# Altium project UU101_UUControl_MainBoard.PrjPcb
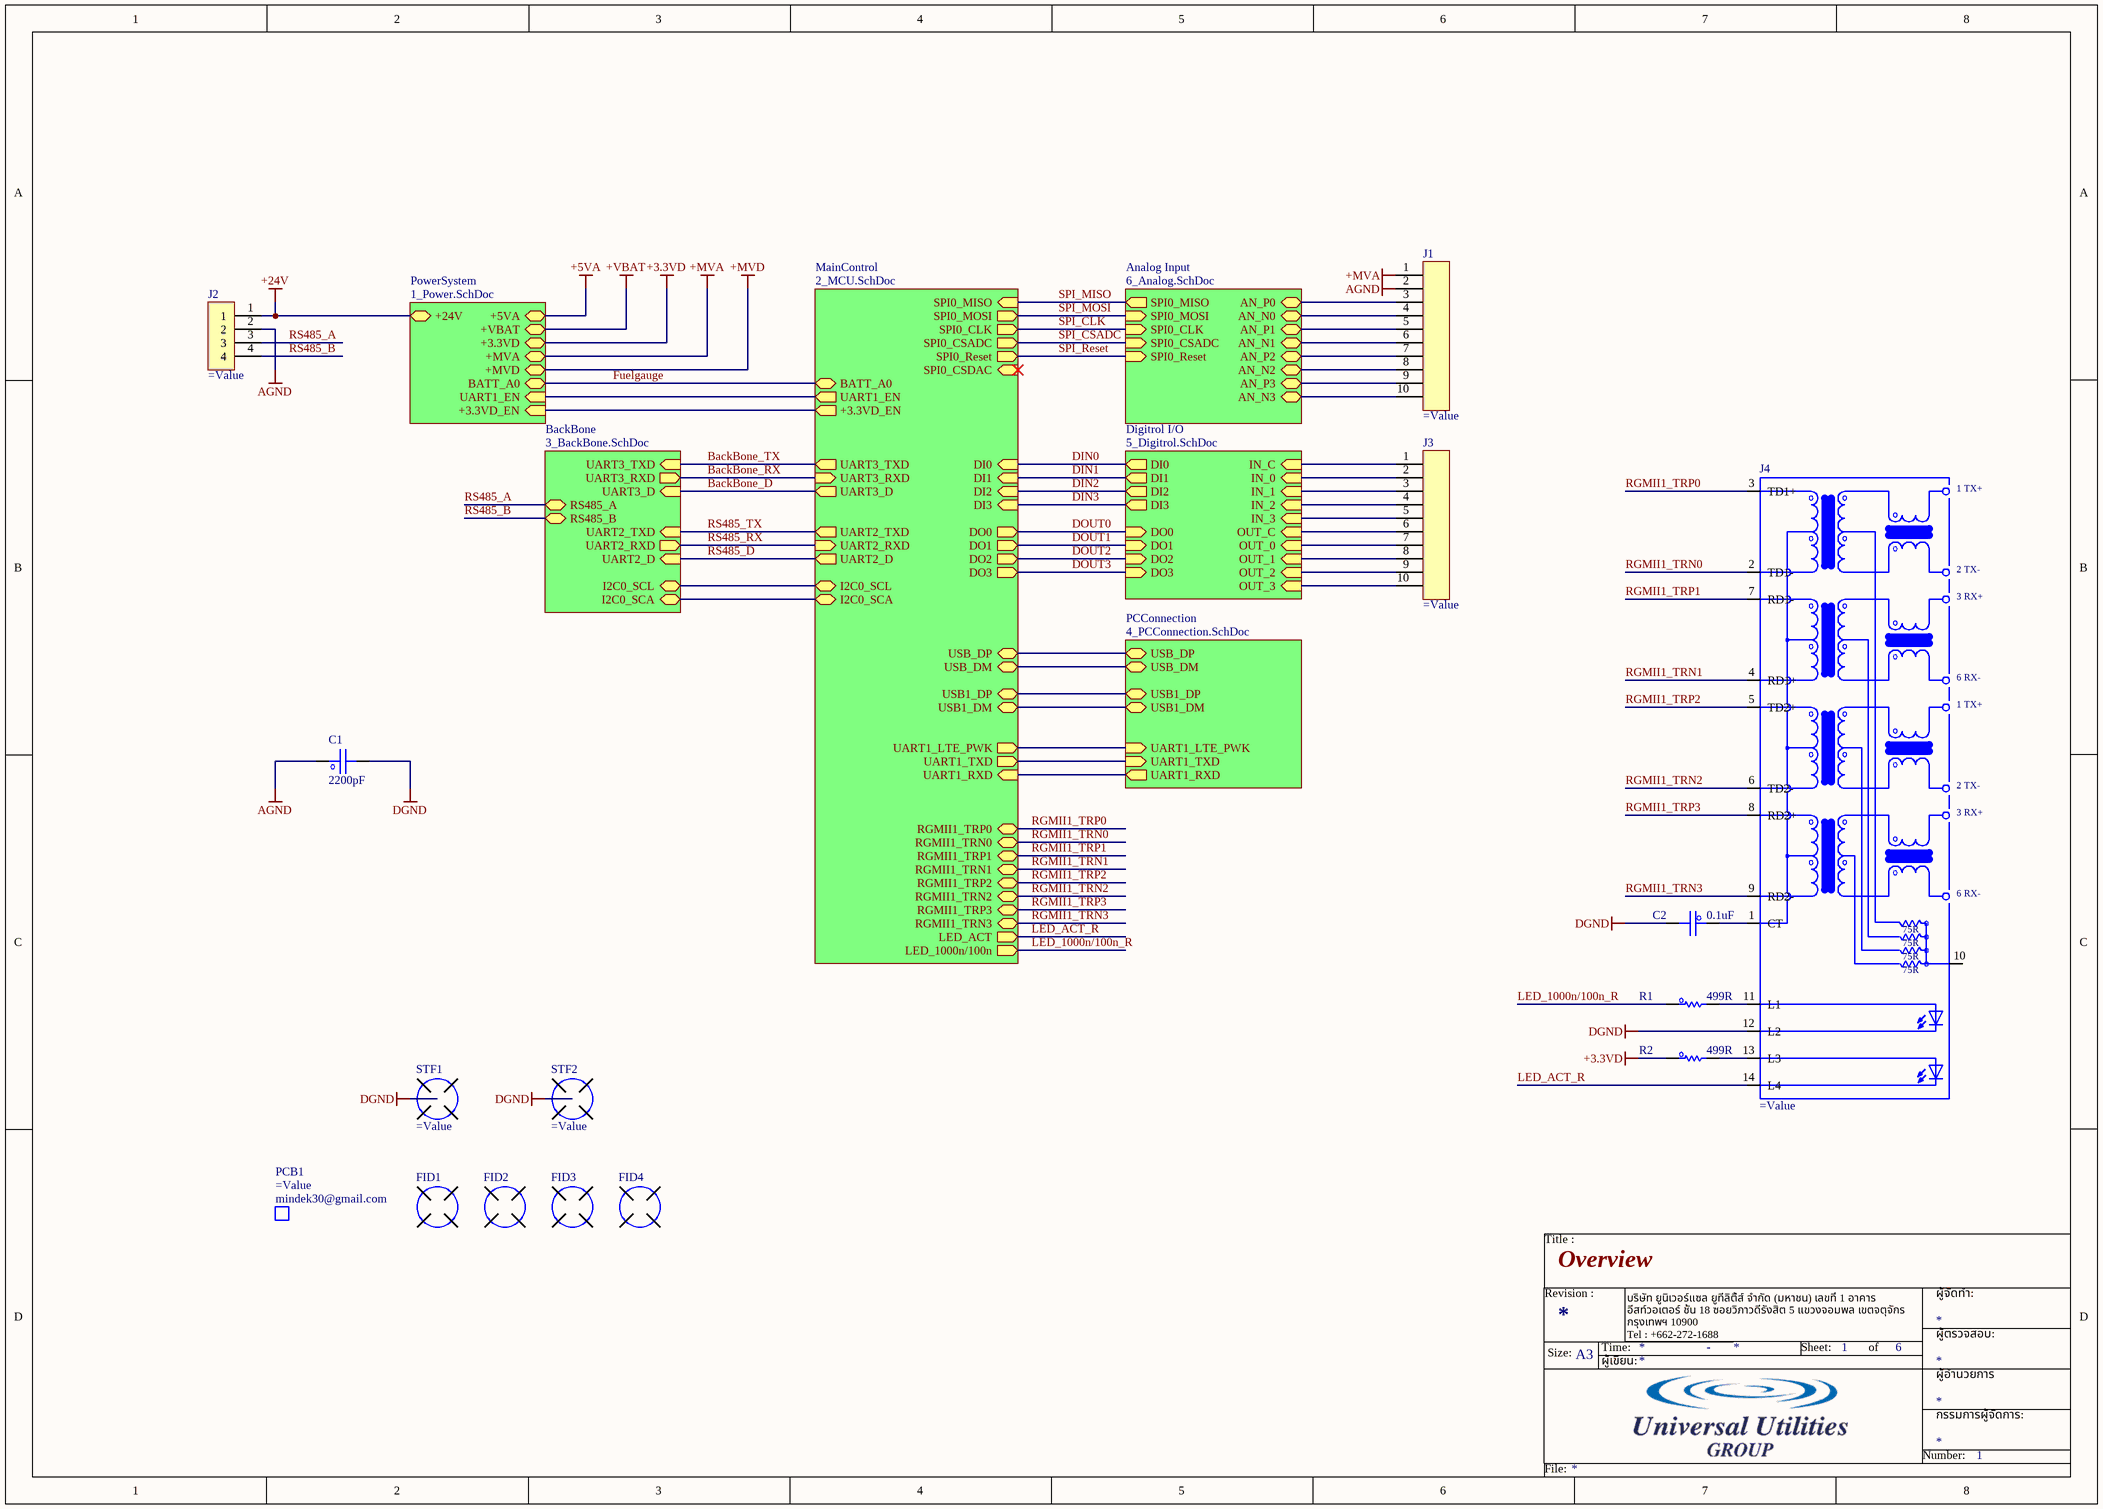
[diagram p0: 0_Overview.SchDoc]
PCB_Name: UU Control Board Mainboard; PCB_PN: UU101; PCB_Rev: B; PCBA_PN: UU101; PCBA_Rev: B
7 sheets, 214 parts. Net scope: hierarchical (ports join the sheet entries above them; power ports are global).
Board file: UU101_UUControl_MainBoard.PcbDoc
Sheets:
  0_Overview.SchDoc
    MainControl = 2_MCU.SchDoc
    Analog Input = 6_Analog.SchDoc
    Digitrol I/O = 5_Digitrol.SchDoc
    PowerSystem = 1_Power.SchDoc
    BackBone = 3_BackBone.SchDoc
    PCConnection = 4_PCConnection.SchDoc

## Sheet 0_Overview.SchDoc: Overview
size A3; DocumentNumber: 1; SheetNumber: 1; SheetTotal: 6; PageSetup: Record=PageOptions|CenterHorizontal=True|CenterVertical=True|PrintScale=1.01|XCorrection=1.00|YCorrection=1.00|PrintKind=0|BorderSize=5000000|LeftOffset=0|BottomOffset=0|Orientation=2|PaperLength=1000|PaperWidth=1000|Scale=100|PaperSource=7|PrintQuality=-4|MediaType=1|DitherType=10|PaperKind=A3|PrintScaleMode=1

### Parts
C1  2200pF  [C_1206]
C2  0.1uF  [C_0603]
FID1  FIDUCIAL  [FID]  (value not drawn)  (no BOM)
FID2  FIDUCIAL  [FID]  (value not drawn)  (no BOM)
FID3  FIDUCIAL  [FID]  (value not drawn)  (no BOM)
FID4  FIDUCIAL  [FID]  (value not drawn)  (no BOM)
J1  (no value)  [CON_10P_Terminal]
J2  (no value)  [CON_4P_Terminal]
J3  (no value)  [CON_10P_Terminal]
J4  (no value)  [HY911103A_HAN]
PCB1  Manufacturer: mindek30@gmail.com  (mechanical)
R1  499R  [R_0603]
R2  499R  [R_0603]
STF1  (no value)  [StandOff]
STF2  (no value)  [StandOff]

### Sub-sheets
Analog Input = 6_Analog.SchDoc: SPI0_MISO (out), SPI0_MOSI (in), SPI0_CLK (in), SPI0_CSADC (in), SPI0_Reset (in), AN_P0 (bidir), AN_P1 (bidir), AN_P2 (bidir), AN_P3 (bidir), AN_N0 (bidir), AN_N1 (bidir), AN_N2 (bidir), AN_N3 (bidir)
BackBone = 3_BackBone.SchDoc: UART2_D (in), UART3_TXD (in), UART3_RXD (out), UART3_D (in), UART2_TXD (in), UART2_RXD (out), RS485_A (bidir), RS485_B (bidir), I2C0_SCL (bidir), I2C0_SCA (bidir)
Digitrol I/O = 5_Digitrol.SchDoc: DI0 (out), DI1 (out), DI2 (out), DI3 (out), DO0 (in), DO1 (in), DO2 (in), DO3 (in), IN_0 (in), IN_1 (in), IN_2 (in), IN_3 (in), OUT_0 (in), OUT_1 (in), OUT_2 (in), OUT_3 (in), OUT_C (in), IN_C (in)
MainControl = 2_MCU.SchDoc: SPI0_MISO (in), SPI0_MOSI (out), SPI0_CLK (out), DI0 (in), DI1 (in), DI2 (in), DI3 (in), DO0 (out), DO1 (out), DO2 (out), DO3 (out), SPI0_Reset (out), UART3_TXD (out), UART3_RXD (in), UART3_D (out), BATT_A0 (bidir), SPI0_CSADC (out), UART2_TXD (out), UART2_RXD (in), UART2_D (out), USB_DP (bidir), USB_DM (bidir), UART1_RXD (in), UART1_EN (out), UART1_TXD (out), I2C0_SCL (bidir), I2C0_SCA (bidir), USB1_DP (bidir), USB1_DM (bidir), RGMII1_TRN0 (bidir), RGMII1_TRP3 (bidir), RGMII1_TRP0 (bidir), RGMII1_TRP2 (bidir), RGMII1_TRP1 (bidir), RGMII1_TRN2 (bidir), RGMII1_TRN3 (bidir), RGMII1_TRN1 (bidir), LED_ACT (out), LED_1000n/100n (out), SPI0_CSDAC (in), +3.3VD_EN (out), UART1_LTE_PWK (out)
PCConnection = 4_PCConnection.SchDoc: UART1_TXD (in), UART1_RXD (out), USB1_DP (bidir), USB1_DM (bidir), USB_DM (bidir), USB_DP (bidir), UART1_LTE_PWK (in)
PowerSystem = 1_Power.SchDoc: +5VA (bidir), +24V (bidir), +3.3VD (bidir), +MVA (bidir), +MVD (bidir), BATT_A0 (bidir), +VBAT (bidir), UART1_EN (in), +3.3VD_EN (in)

### Nets
+3.3VD: R2.1 ; sheet PowerSystem/+3.3VD
+24V: J2.1 ; sheet PowerSystem/+24V
+MVA: J1.1 ; sheet PowerSystem/+MVA
AGND: C1.1 J1.2 J2.2
DGND: C1.2 C2.2 J4.12(L2) STF1.1 STF2.1
BackBone_D: sheet MainControl/UART3_D, sheet BackBone/UART3_D
BackBone_RX: sheet MainControl/UART3_RXD, sheet BackBone/UART3_RXD
BackBone_TX: sheet MainControl/UART3_TXD, sheet BackBone/UART3_TXD
DIN0: sheet MainControl/DI0, sheet Digitrol I/O/DI0
DIN1: sheet MainControl/DI1, sheet Digitrol I/O/DI1
DIN2: sheet MainControl/DI2, sheet Digitrol I/O/DI2
DIN3: sheet MainControl/DI3, sheet Digitrol I/O/DI3
DOUT0: sheet MainControl/DO0, sheet Digitrol I/O/DO0
DOUT1: sheet MainControl/DO1, sheet Digitrol I/O/DO1
DOUT2: sheet MainControl/DO2, sheet Digitrol I/O/DO2
DOUT3: sheet MainControl/DO3, sheet Digitrol I/O/DO3
Fuelgauge: sheet MainControl/BATT_A0, sheet PowerSystem/BATT_A0
HUSB1_DM: sheet MainControl/USB1_DM, sheet PCConnection/USB1_DM
HUSB1_DP: sheet MainControl/USB1_DP, sheet PCConnection/USB1_DP
I2C0_SCA: sheet MainControl/I2C0_SCA, sheet BackBone/I2C0_SCA
I2C0_SCL: sheet MainControl/I2C0_SCL, sheet BackBone/I2C0_SCL
INCom: J3.1 ; sheet Digitrol I/O/IN_C
INPUT0: J3.2 ; sheet Digitrol I/O/IN_0
INPUT1: J3.3 ; sheet Digitrol I/O/IN_1
INPUT2: J3.4 ; sheet Digitrol I/O/IN_2
INPUT3: J3.5 ; sheet Digitrol I/O/IN_3
LED_1000n/100n_R: R1.1 ; sheet MainControl/LED_1000n/100n
LED_ACT_R: J4.14(L4) ; sheet MainControl/LED_ACT  [project net LED_ACT]
OUTCom: J3.6 ; sheet Digitrol I/O/OUT_C
OUTPUT0: J3.7 ; sheet Digitrol I/O/OUT_0
OUTPUT1: J3.8 ; sheet Digitrol I/O/OUT_1
OUTPUT2: J3.9 ; sheet Digitrol I/O/OUT_2
OUTPUT3: J3.10 ; sheet Digitrol I/O/OUT_3
RGMII1_TRN0: J4.2(TD1-) ; sheet MainControl/RGMII1_TRN0
RGMII1_TRN1: J4.4(RD1+) ; sheet MainControl/RGMII1_TRN1
RGMII1_TRN2: J4.6(TD2-) ; sheet MainControl/RGMII1_TRN2
RGMII1_TRN3: J4.9(RD2-) ; sheet MainControl/RGMII1_TRN3
RGMII1_TRP0: J4.3(TD1+) ; sheet MainControl/RGMII1_TRP0
RGMII1_TRP1: J4.7(RD1-) ; sheet MainControl/RGMII1_TRP1
RGMII1_TRP2: J4.5(TD2+) ; sheet MainControl/RGMII1_TRP2
RGMII1_TRP3: J4.8(RD2+) ; sheet MainControl/RGMII1_TRP3
RS485_A: J2.3 ; sheet BackBone/RS485_A
RS485_B: J2.4 ; sheet BackBone/RS485_B
RS485_D: sheet MainControl/UART2_D, sheet BackBone/UART2_D
RS485_RX: sheet MainControl/UART2_RXD, sheet BackBone/UART2_RXD
RS485_TX: sheet MainControl/UART2_TXD, sheet BackBone/UART2_TXD
SIM_RESET: sheet MainControl/UART1_LTE_PWK, sheet PCConnection/UART1_LTE_PWK
SPI_CLK: sheet MainControl/SPI0_CLK, sheet Analog Input/SPI0_CLK  [project net SPI0_SCK]
SPI_CSADC: sheet MainControl/SPI0_CSADC, sheet Analog Input/SPI0_CSADC
SPI_MISO: sheet MainControl/SPI0_MISO, sheet Analog Input/SPI0_MISO  [project net SPI0_MISO]
SPI_MOSI: sheet MainControl/SPI0_MOSI, sheet Analog Input/SPI0_MOSI  [project net SPI0_MOSI]
SPI_Reset: sheet MainControl/SPI0_Reset, sheet Analog Input/SPI0_Reset
UART1_LTE_EN: sheet MainControl/UART1_EN, sheet PowerSystem/UART1_EN
UART1_LTE_RX: sheet MainControl/UART1_RXD, sheet PCConnection/UART1_RXD
UART1_LTE_TX: sheet MainControl/UART1_TXD, sheet PCConnection/UART1_TXD
USB_DM: sheet MainControl/USB_DP, sheet PCConnection/USB_DP
USB_DP: sheet MainControl/USB_DM, sheet PCConnection/USB_DM
NetC2_1: C2.1 J4.1(CT)
NetJ1_3: J1.3 ; sheet Analog Input/AN_P0
NetJ1_4: J1.4 ; sheet Analog Input/AN_N0
NetJ1_5: J1.5 ; sheet Analog Input/AN_P1
NetJ1_6: J1.6 ; sheet Analog Input/AN_N1
NetJ1_7: J1.7 ; sheet Analog Input/AN_P2
NetJ1_8: J1.8 ; sheet Analog Input/AN_N2
NetJ1_9: J1.9 ; sheet Analog Input/AN_P3
NetJ1_10: J1.10 ; sheet Analog Input/AN_N3
NetJ4_11: J4.11(L1) R1.2
NetJ4_13: J4.13(L3) R2.2
NetJ201_12: sheet MainControl/+3.3VD_EN, sheet PowerSystem/+3.3VD_EN

Not connected (* = marked no-connect by the designer): J4 10(CT)

### Notes on the sheet
- Title :
- Revision :
- ผู้จัดทำ:
- Size:
- A3
- Time:
- ผู้เขียน:
- บริษัท ยูนิเวอร์แซล ยูทีลิตี้ส์ จำกัด (มหาชน) เลขที่ 1 อาคาร อีสท์วอเตอร์ ชั้น 18 ซอยวิภาวดีรังสิต 5 แขวงจอมพล เขตจตุจักร กรุงเทพฯ 10900
  Tel : +662-272-1688
  Fax :+662-2721690-1
- -
- Sheet:
- of
- ผู้อำนวยการ
- ผู้ตรวจสอบ:
- Number:
- กรรมการผู้จัดการ:
- File:
- (in symbol CON_RJ45_1) 1 TX+; 2 TX-; 3 RX+; 6 RX-; 75R

### Library data of the parts
C1 = C_Capacitor: CAP CER 2200PF 1KV X7R 1206; Manufacturer: AVX Corporation; PartNumber: 1206AC222KAT1A; PackageReference: 1206; PartID: 478-2953-1-ND; Value2: 1kV; Value: 2200pF; Value3: *
C2 = C_Capacitor: CAP CER 0.1UF 50V X7R 0603; Manufacturer: KEMET; PartNumber: C0603C104K5RACTU; PackageReference: 0603; PartID: 399-5089-1-ND; Value2: 50V; Value: 0.1uF; Value3: *
FID1-FID4 = FID_FIDUCIAL: Manufacturer: mindek30@gmail.com; PartNumber: UU101_B; Value2: Non SE; Value: Non SE; PartID: B; PackageReference: Non SE; Value3: Non SE
J1 J3 = CON_10P_Terminal: TERM BLOCK HDR 10POS 90DEG 3.5MM; PartNumber: 1843871; Manufacturer: Phoenix Contact; Value: 1843871; Value3: 1966172; PartID: 277-6521-ND; PackageReference: *; Value2: *
J2 = CON_4P_Terminal: TERM BLOCK HDR 4POS 90DEG 3.5MM; PartNumber: 1843813; Manufacturer: Phoenix Contact; Value: 1843813; PartID: 277-6088-ND; PackageReference: *; Value2: *; Value3: *
J4 = CON_RJ45_1: RJ45 RJReceptacle 1 Internal oscillator included Internal oscillator included Plugin Ethernet Connectors/Modular Connectors (RJ45 RJ11) ROHS; PartNumber: HY911103A; Manufacturer: HANRUN(Zhongshan HanRun Elec); Value: HY911103A; PartID: C55679; PackageReference: *; Value2: *; Value3: *
PCB1 = PCB_Bare: BARE PCB; PartNumber: UU101_B; PackageReference: Non SE; PartID: B; Value2: =JobFile_Title; Value: =PartNumber; Value3: UU101_B
R1 R2 = R_Resister: RES 499 OHM 1% 1/10W 0603; Manufacturer: Vishay Dale; PartNumber: CRCW0603499RFKEAC; Value2: 0.1W; Value: 499R; PackageReference: 0603; PartID: 541-3986-1-ND; Value3: *
STF1 STF2 = FID_STANDOFF: ROUND STANDOFF M2X0.4 STEEL 2MM; Manufacturer: Würth Elektronik; PartNumber: 9774020243R; Value: 9774020243R; PartID: 732-7073-1-ND; PackageReference: *; Value2: *; Value3: *

## Sheet 2_MCU.SchDoc
size A3; DocumentNumber: 3; SheetNumber: 3; SheetTotal: 6; PageSetup: Record=PageOptions|CenterHorizontal=True|CenterVertical=True|PrintScale=1.01|XCorrection=1.00|YCorrection=1.00|PrintKind=0|BorderSize=5000000|LeftOffset=0|BottomOffset=0|Orientation=2|PaperLength=1000|PaperWidth=1000|Scale=100|PaperSource=7|PrintQuality=-4|MediaType=1|DitherType=10|PaperKind=A3|PrintScaleMode=1
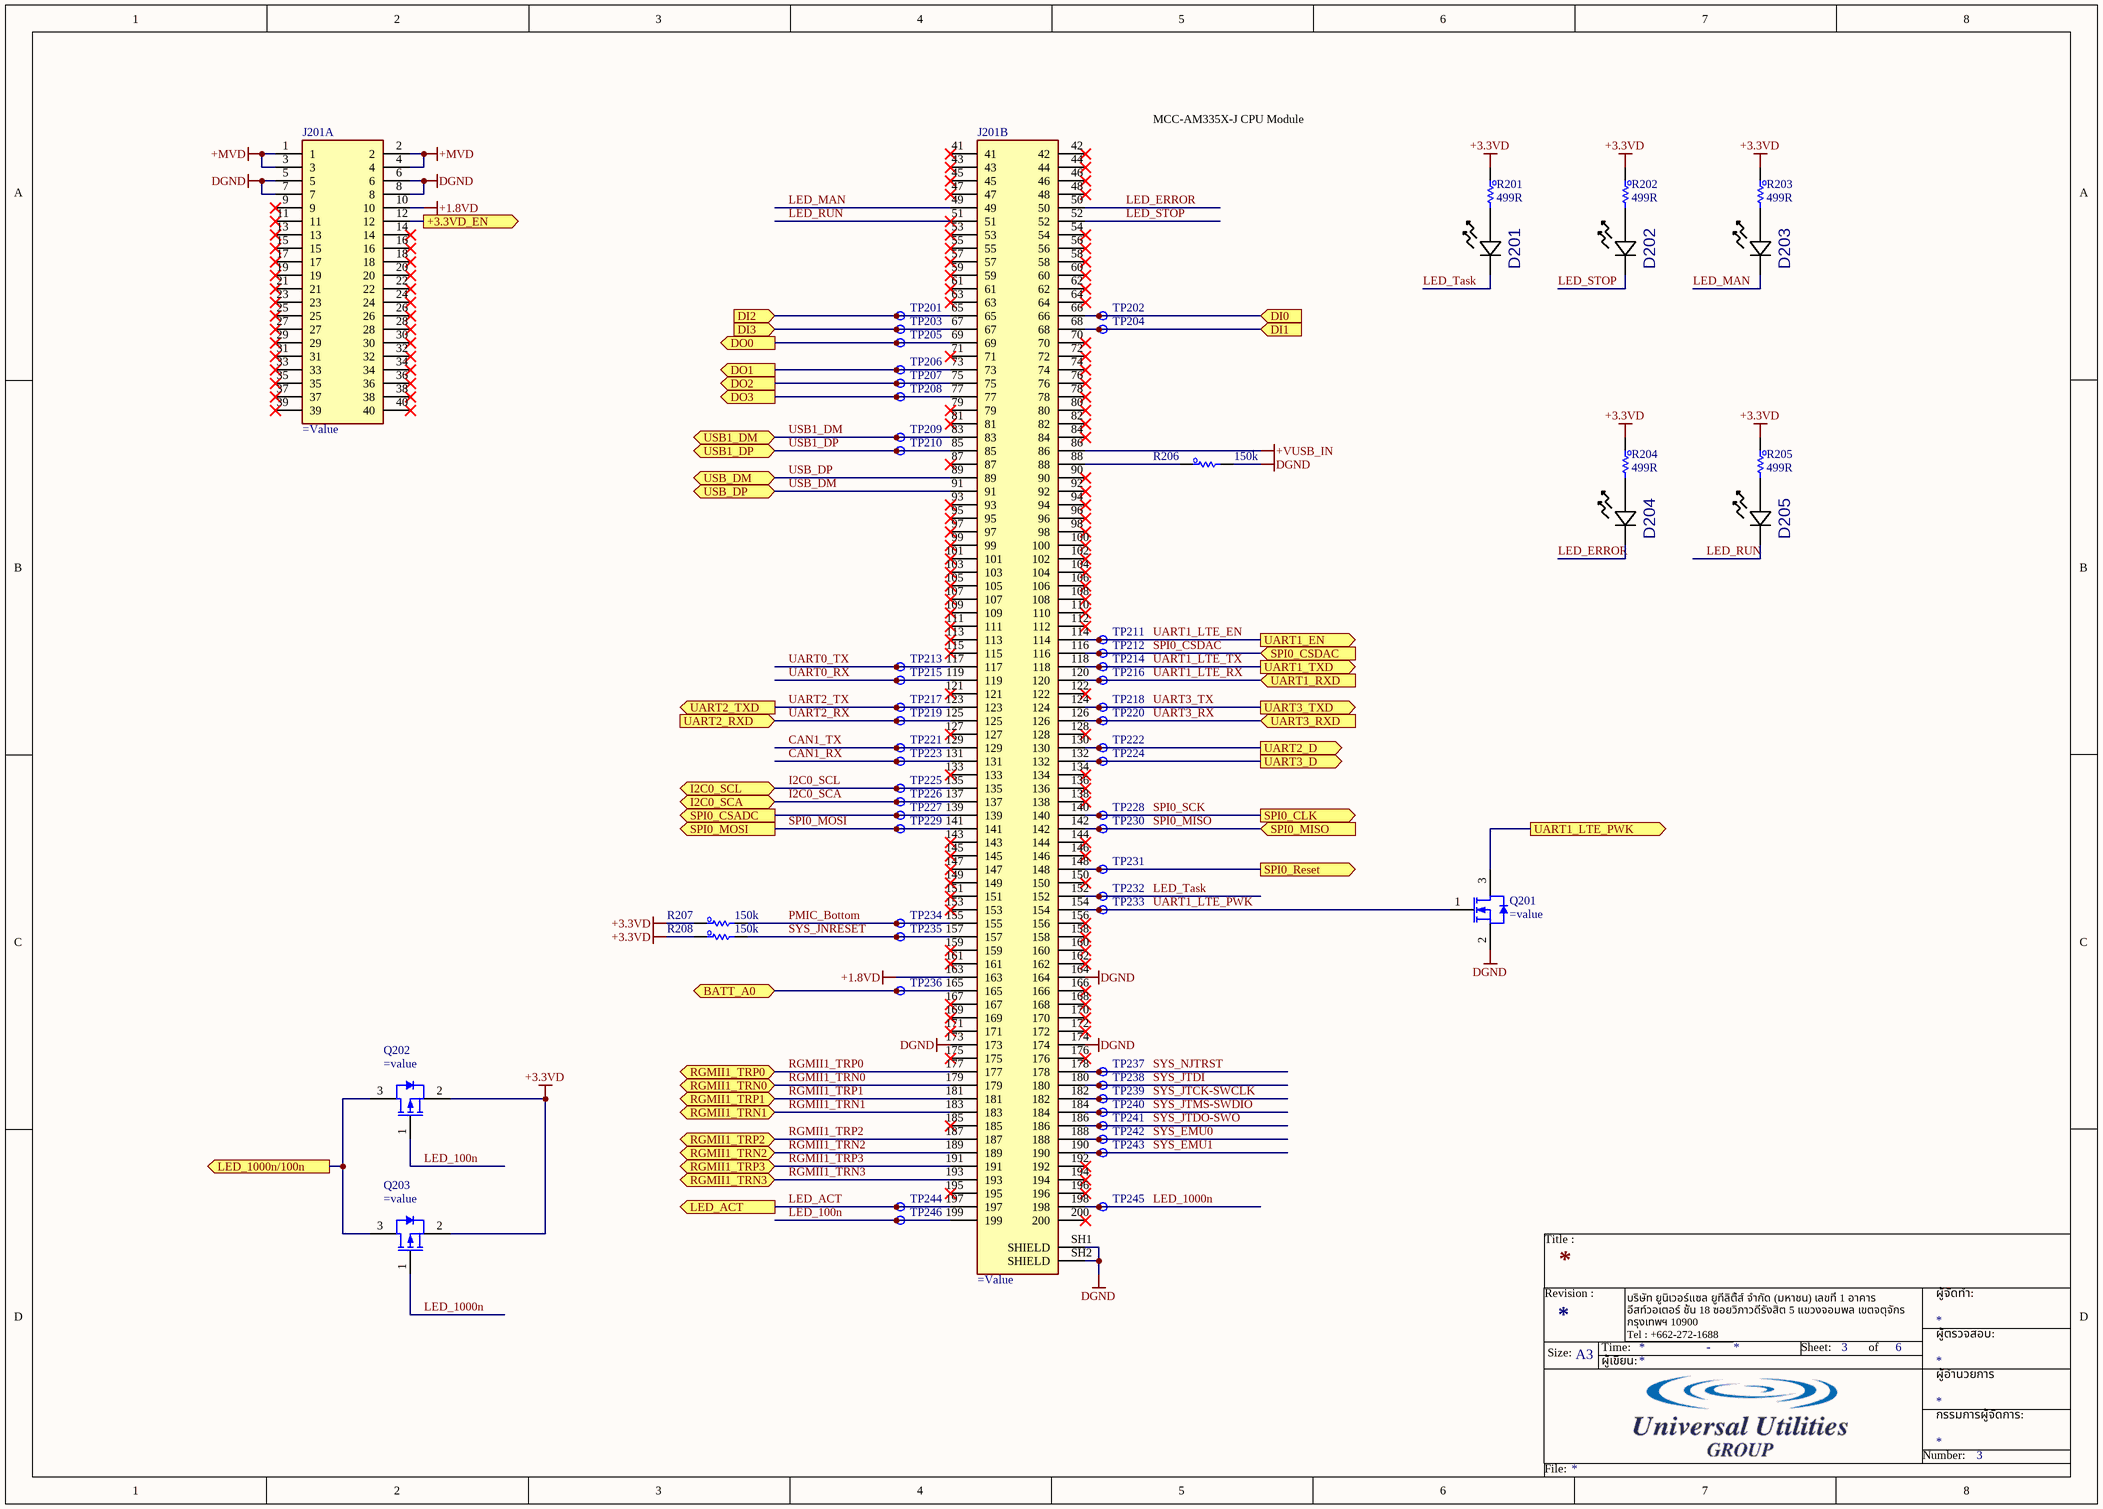
[diagram p1: 2_MCU.SchDoc]

### Parts
D201  (no value)  [LED_0VS75000_WRE]
D202  (no value)  [LED_0VS75000_WRE]
D203  (no value)  [LED_0VS75000_WRE]
D204  (no value)  [LED_0VS75000_WRE]
D205  (no value)  [LED_0VS75000_WRE]
J201  (no value)  [TE_1473149-4]  (parts A,B of 2)
Q201  (no value)  [SOT95P245X110-3M]
Q202  (no value)  [SOT95P245X110-3M]
Q203  (no value)  [SOT95P245X110-3M]
R201  499R  [R_0603]
R202  499R  [R_0603]
R203  499R  [R_0603]
R204  499R  [R_0603]
R205  499R  [R_0603]
R206  150k  [R_0603]
R207  150k  [R_0603]
R208  150k  [R_0603]
TP201  (no value)  [TP_Testpoint]  (no BOM)
TP202  (no value)  [TP_Testpoint]  (no BOM)
TP203  (no value)  [TP_Testpoint]  (no BOM)
TP204  (no value)  [TP_Testpoint]  (no BOM)
TP205  (no value)  [TP_Testpoint]  (no BOM)
TP206  (no value)  [TP_Testpoint]  (no BOM)
TP207  (no value)  [TP_Testpoint]  (no BOM)
TP208  (no value)  [TP_Testpoint]  (no BOM)
TP209  (no value)  [TP_Testpoint]  (no BOM)
TP210  (no value)  [TP_Testpoint]  (no BOM)
TP211  (no value)  [TP_Testpoint]  (no BOM)
TP212  (no value)  [TP_Testpoint]  (no BOM)
TP213  (no value)  [TP_Testpoint]  (no BOM)
TP214  (no value)  [TP_Testpoint]  (no BOM)
TP215  (no value)  [TP_Testpoint]  (no BOM)
TP216  (no value)  [TP_Testpoint]  (no BOM)
TP217  (no value)  [TP_Testpoint]  (no BOM)
TP218  (no value)  [TP_Testpoint]  (no BOM)
TP219  (no value)  [TP_Testpoint]  (no BOM)
TP220  (no value)  [TP_Testpoint]  (no BOM)
TP221  (no value)  [TP_Testpoint]  (no BOM)
TP222  (no value)  [TP_Testpoint]  (no BOM)
TP223  (no value)  [TP_Testpoint]  (no BOM)
TP224  (no value)  [TP_Testpoint]  (no BOM)
TP225  (no value)  [TP_Testpoint]  (no BOM)
TP226  (no value)  [TP_Testpoint]  (no BOM)
TP227  (no value)  [TP_Testpoint]  (no BOM)
TP228  (no value)  [TP_Testpoint]  (no BOM)
TP229  (no value)  [TP_Testpoint]  (no BOM)
TP230  (no value)  [TP_Testpoint]  (no BOM)
TP231  (no value)  [TP_Testpoint]  (no BOM)
TP232  (no value)  [TP_Testpoint]  (no BOM)
TP233  (no value)  [TP_Testpoint]  (no BOM)
TP234  (no value)  [TP_Testpoint]  (no BOM)
TP235  (no value)  [TP_Testpoint]  (no BOM)
TP236  (no value)  [TP_Testpoint]  (no BOM)
TP237  (no value)  [TP_Testpoint]  (no BOM)
TP238  (no value)  [TP_Testpoint]  (no BOM)
TP239  (no value)  [TP_Testpoint]  (no BOM)
TP240  (no value)  [TP_Testpoint]  (no BOM)
TP241  (no value)  [TP_Testpoint]  (no BOM)
TP242  (no value)  [TP_Testpoint]  (no BOM)
TP243  (no value)  [TP_Testpoint]  (no BOM)
TP244  (no value)  [TP_Testpoint]  (no BOM)
TP245  (no value)  [TP_Testpoint]  (no BOM)
TP246  (no value)  [TP_Testpoint]  (no BOM)

### Ports
+3.3VD_EN (out), BATT_A0 (bidir), DI0 (in), DI1 (in), DI2 (in), DI3 (in), DO0 (out), DO1 (out), DO2 (out), DO3 (out), I2C0_SCA (bidir), I2C0_SCL (bidir), LED_1000n/100n (out), LED_ACT (out), RGMII1_TRN0 (bidir), RGMII1_TRN1 (bidir), RGMII1_TRN2 (bidir), RGMII1_TRN3 (bidir), RGMII1_TRP0 (bidir), RGMII1_TRP1 (bidir), RGMII1_TRP2 (bidir), RGMII1_TRP3 (bidir), SPI0_CLK (out), SPI0_CSADC (out), SPI0_CSDAC (in), SPI0_MISO (in), SPI0_MOSI (out), SPI0_Reset (out), UART1_EN (out), UART1_LTE_PWK (out), UART1_RXD (in), UART1_TXD (out), UART2_D (out), UART2_RXD (in), UART2_TXD (out), UART3_D (out), UART3_RXD (in), UART3_TXD (out), USB1_DM (bidir), USB1_DP (bidir), USB_DM (bidir), USB_DP (bidir)

### Nets
+1.8VD: J201.10 J201.163
+3.3VD: Q202.2(S) Q203.2(S) R201.1 R202.1 R203.1 R204.1 R205.1 R207.1 R208.1
+MVD: J201.1 J201.2 J201.3 J201.4
+VUSB_IN: J201.86
DGND: J201.5 J201.6 J201.7 J201.8 J201.164 J201.173 J201.174 J201.SH1(SHIELD) J201.SH2(SHIELD) Q201.2(S) R206.2
BackBone_D: J201.132 TP224.1 ; port UART3_D
CAN1_RX: J201.131 TP223.1
CAN1_TX: J201.129 TP221.1
DIN0: J201.66 TP202.1 ; port DI0
DIN1: J201.68 TP204.1 ; port DI1
DIN2: J201.65 TP201.1 ; port DI2
DIN3: J201.67 TP203.1 ; port DI3
DOUT0: J201.69 TP205.1 ; port DO0
DOUT1: J201.73 TP206.1 ; port DO1
DOUT2: J201.75 TP207.1 ; port DO2
DOUT3: J201.77 TP208.1 ; port DO3
Fuelgauge: J201.165 TP236.1 ; port BATT_A0
I2C0_SCA: J201.137 TP226.1 ; port I2C0_SCA
I2C0_SCL: J201.135 TP225.1 ; port I2C0_SCL
LED_100n: J201.199 Q202.1(G) TP246.1
LED_1000n: J201.198 Q203.1(G) TP245.1
LED_1000n/100n_R: Q202.3(D) Q203.3(D) ; port LED_1000n/100n
LED_ACT: J201.197 TP244.1 ; port LED_ACT
LED_ERROR: D204.1 J201.50
LED_MAN: D203.1 J201.49
LED_RUN: D205.1 J201.51
LED_STOP: D202.1 J201.52
LED_Task: D201.1 J201.152 TP232.1
PMIC_Bottom: J201.155 R207.2 TP234.1
RGMII1_TRN0: J201.179 ; port RGMII1_TRN0
RGMII1_TRN1: J201.183 ; port RGMII1_TRN1
RGMII1_TRN2: J201.189 ; port RGMII1_TRN2
RGMII1_TRN3: J201.193 ; port RGMII1_TRN3
RGMII1_TRP0: J201.177 ; port RGMII1_TRP0
RGMII1_TRP1: J201.181 ; port RGMII1_TRP1
RGMII1_TRP2: J201.187 ; port RGMII1_TRP2
RGMII1_TRP3: J201.191 ; port RGMII1_TRP3
RS485_D: J201.130 TP222.1 ; port UART2_D
SIM_RESET: Q201.3(D) ; port UART1_LTE_PWK
SPI0_CSDAC: J201.116 TP212.1 ; port SPI0_CSDAC
SPI0_MISO: J201.142 TP230.1 ; port SPI0_MISO
SPI0_MOSI: J201.141 TP229.1 ; port SPI0_MOSI
SPI0_SCK: J201.140 TP228.1 ; port SPI0_CLK
SPI_CSADC: J201.139 TP227.1 ; port SPI0_CSADC
SPI_Reset: J201.148 TP231.1 ; port SPI0_Reset
SYS_EMU0: J201.188 TP242.1
SYS_EMU1: J201.190 TP243.1
SYS_JNRESET: J201.157 R208.2 TP235.1
SYS_JTCK-SWCLK: J201.182 TP239.1
SYS_JTDI: J201.180 TP238.1
SYS_JTDO-SWO: J201.186 TP241.1
SYS_JTMS-SWDIO: J201.184 TP240.1
SYS_NJTRST: J201.178 TP237.1
UART0_RX: J201.119 TP215.1
UART0_TX: J201.117 TP213.1
UART1_LTE_EN: J201.114 TP211.1 ; port UART1_EN
UART1_LTE_PWK: J201.154 Q201.1(G) TP233.1
UART1_LTE_RX: J201.120 TP216.1 ; port UART1_RXD
UART1_LTE_TX: J201.118 TP214.1 ; port UART1_TXD
UART2_RX: J201.125 TP219.1 ; port UART2_RXD  [project net RS485_RX]
UART2_TX: J201.123 TP217.1 ; port UART2_TXD  [project net RS485_TX]
UART3_RX: J201.126 TP220.1 ; port UART3_RXD  [project net BackBone_RX]
UART3_TX: J201.124 TP218.1 ; port UART3_TXD  [project net BackBone_TX]
USB1_DM: J201.83 TP209.1 ; port USB1_DM  [project net HUSB1_DM]
USB1_DP: J201.85 TP210.1 ; port USB1_DP  [project net HUSB1_DP]
USB_DM: J201.91 ; port USB_DP
USB_DP: J201.89 ; port USB_DM
NetD201_2: D201.2 R201.2
NetD202_2: D202.2 R202.2
NetD203_2: D203.2 R203.2
NetD204_2: D204.2 R204.2
NetD205_2: D205.2 R205.2
NetJ201_12: J201.12 ; port +3.3VD_EN
NetJ201_88: J201.88 R206.1

Not connected (* = marked no-connect by the designer): J201 9* 11* 13* 14* 15* 16* 17* 18* 19* 20* 21* 22* 23* 24* 25* 26* 27* 28* 29* 30* 31* 32* 33* 34* 35* 36* 37* 38* 39* 40* 41* 42* 43* 44* 45* 46* 47* 48* 53* 54* 55* 56* 57* 58* 59* 60* 61* 62* 63* 64* 70* 71* 72* 74* 76* 78* 79* 80* 81* 82* 84* 87* 90* 92* 93* 94* 95* 96* 97* 98* 99* 100* 101* 102* 103* 104* 105* 106* 107* 108* 109* 110* 111* 112* 113* 115* 121* 122* 127* 128* 133* 134* 136* 138* 143* 144* 145* 146* 147* 149* 150* 151* 153* 156* 158* 159* 160* 161* 162* 166* 167* 168* 169* 170* 171* 172* 175* 176* 185* 192* 194* 195* 196* 200*

### Notes on the sheet
- MCC-AM335X-J CPU Module
- Title :
- Revision :
- ผู้จัดทำ:
- Size:
- A3
- Time:
- ผู้เขียน:
- บริษัท ยูนิเวอร์แซล ยูทีลิตี้ส์ จำกัด (มหาชน) เลขที่ 1 อาคาร อีสท์วอเตอร์ ชั้น 18 ซอยวิภาวดีรังสิต 5 แขวงจอมพล เขตจตุจักร กรุงเทพฯ 10900
  Tel : +662-272-1688
  Fax :+662-2721690-1
- -
- Sheet:
- of
- ผู้อำนวยการ
- ผู้ตรวจสอบ:
- Number:
- กรรมการผู้จัดการ:
- File:

### Library data of the parts
D201-D205 = D_LED_150060BS75000: LED BLUE CLEAR 0603 SMD; Manufacturer: Wurth Electronics; Value: 150060VS75000; PackageReference: 0603; PartID: 732-4980-1-ND; PartNumber: 150060VS75000
J201 = CON_DDR2: CONN SKT SODIMM 200POS R/A SMD; PartNumber: 1473149-4; Manufacturer: TE Connectivity AMP Connectors; Value: 1473149-4; PartID: A114854-ND; PackageReference: *; Value2: *; Value3: *
Q201 = Q_NMOS_2N7002H: MOSFET N-CH 60V 300MA SOT23-3; Manufacturer: Infineon Technologies; Value: 2N7002H6327XTSA2; PackageReference: SOT23; PartID: 2N7002H6327XTSA2CT-ND; PartNumber: 2N7002H6327XTSA2; Value3: *
Q202 Q203 = Q_PMOS_BSS84: MOSFET P-CH 60V 170MA SOT23-3; Manufacturer: Infineon Technologies; Value: BSS84PH6327XTSA2; PackageReference: SOT23; PartID: BSS84PH6327XTSA2CT-ND; PartNumber: BSS84PH6327XTSA2; Value3: *
R201-R205 = R_Resister: as R1 on sheet 0_Overview; Value: 499R; PackageReference: 0603; PartID: 541-3986-1-ND; Value3: *
R206-R208 = R_Resister: RES SMD 150K OHM 1% 1/10W 0603; Manufacturer: Vishay Dale; PartNumber: CRCW0603150KFKEAC; Value2: 0.1W; Value: 150k; PackageReference: 0603; PartID: 541-4034-1-ND; Value3: *
TP201-TP246 = TP_TestPoint: TestPoint; Manufacturer: *; PackageReference: *; PartID: *; PartNumber: *; Value2: *; Value3: *

## Sheet 6_Analog.SchDoc
size A3; DocumentNumber: 6; SheetNumber: 6; SheetTotal: 6
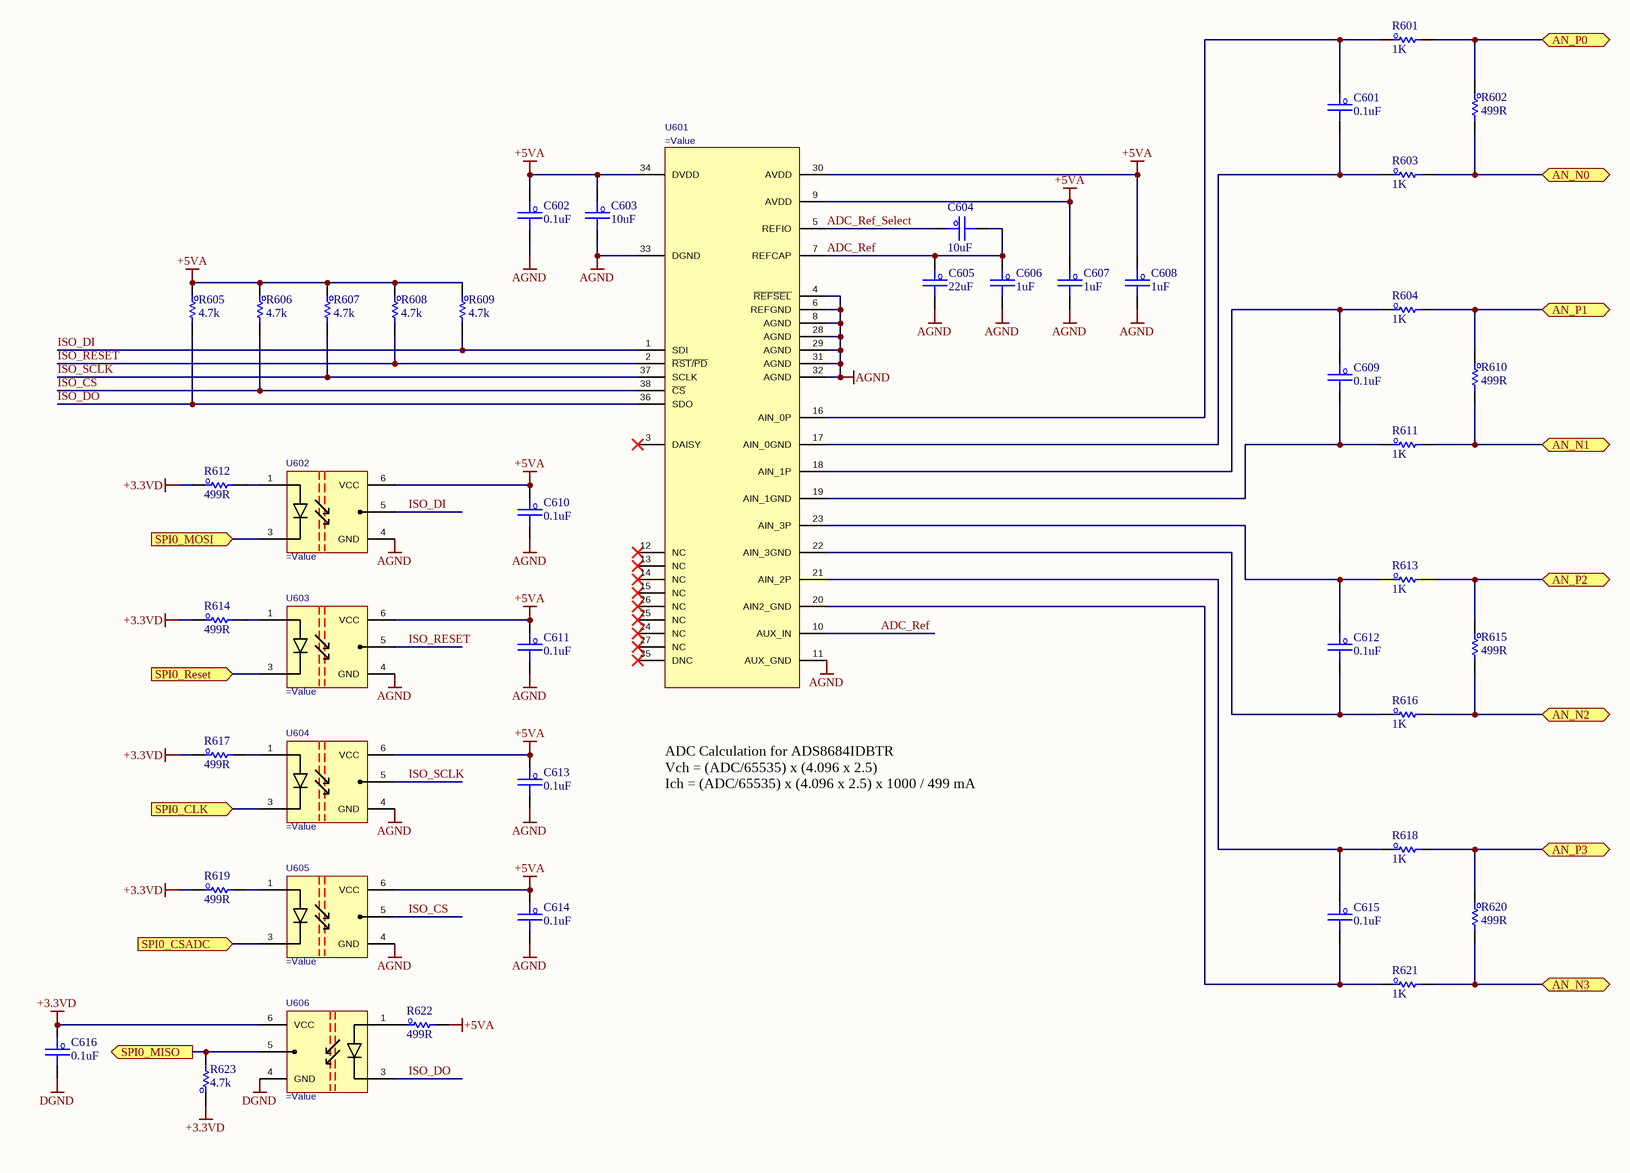
[diagram p2: 6_Analog.SchDoc]

### Parts
C601  0.1uF  [C_0603]
C602  0.1uF  [C_0603]
C603  10uF  [C_0603]
C604  10uF  [C_0603]
C605  22uF  [C_0603]
C606  1uF  [C_0603]
C607  1uF  [C_0603]
C608  1uF  [C_0603]
C609  0.1uF  [C_0603]
C610  0.1uF  [C_0603]
C611  0.1uF  [C_0603]
C612  0.1uF  [C_0603]
C613  0.1uF  [C_0603]
C614  0.1uF  [C_0603]
C615  0.1uF  [C_0603]
C616  0.1uF  [C_0603]
R601  1K  [R_0603]
R602  499R  [R_0603]
R603  1K  [R_0603]
R604  1K  [R_0603]
R605  4.7k  [R_0603]
R606  4.7k  [R_0603]
R607  4.7k  [R_0603]
R608  4.7k  [R_0603]
R609  4.7k  [R_0603]
R610  499R  [R_0603]
R611  1K  [R_0603]
R612  499R  [R_0603]
R613  1K  [R_0603]
R614  499R  [R_0603]
R615  499R  [R_0603]
R616  1K  [R_0603]
R617  499R  [R_0603]
R618  1K  [R_0603]
R619  499R  [R_0603]
R620  499R  [R_0603]
R621  1K  [R_0603]
R622  499R  [R_0603]
R623  4.7k  [R_0603]
U601  (no value)  [DBT0038A_N_TEX]
U602  (no value)  [5PIN SO6_TOS]
U603  (no value)  [5PIN SO6_TOS]
U604  (no value)  [5PIN SO6_TOS]
U605  (no value)  [5PIN SO6_TOS]
U606  (no value)  [5PIN SO6_TOS]

### Ports
AN_N0 (bidir), AN_N1 (bidir), AN_N2 (bidir), AN_N3 (bidir), AN_P0 (bidir), AN_P1 (bidir), AN_P2 (bidir), AN_P3 (bidir), SPI0_CLK (in), SPI0_CSADC (in), SPI0_MISO (out), SPI0_MOSI (in), SPI0_Reset (in)

### Nets
+3.3VD: C616.1 R612.1 R614.1 R617.1 R619.1 R623.1 U606.6(VCC)
+5VA: C602.1 C603.1 C607.1 C608.1 C610.1 C611.1 C613.1 C614.1 R605.1 R606.1 R607.1 R608.1 R609.1 R622.2 U601.9(AVDD) U601.30(AVDD) U601.34(DVDD) U602.6(VCC) U603.6(VCC) U604.6(VCC) U605.6(VCC)
AGND: C602.2 C603.2 C605.2 C606.2 C607.2 C608.2 C610.2 C611.2 C613.2 C614.2 U601.4(~{REFSEL}) U601.6(REFGND) U601.8(AGND) U601.11(AUX_GND) U601.28(AGND) U601.29(AGND) U601.31(AGND) U601.32(AGND) U601.33(DGND) U602.4(GND) U603.4(GND) U604.4(GND) U605.4(GND)
DGND: C616.2 U606.4(GND)
ADC_Ref: C604.2 C605.1 C606.1 U601.7(REFCAP) U601.10(AUX_IN)
ADC_Ref_Select: C604.1 U601.5(REFIO)
ISO_CS: R606.2 U601.38(~{CS}) U605.5(O1)
ISO_DI: R609.2 U601.1(SDI) U602.5(O1)
ISO_DO: R605.2 U601.36(SDO) U606.3(A)
ISO_RESET: R608.2 U601.2(~{RST}/~{PD}) U603.5(O1)
ISO_SCLK: R607.2 U601.37(SCLK) U604.5(O1)
SPI0_MISO: R623.2 U606.5(O1) ; port SPI0_MISO
SPI0_MOSI: U602.3(A) ; port SPI0_MOSI
SPI0_SCK: U604.3(A) ; port SPI0_CLK
SPI_CSADC: U605.3(A) ; port SPI0_CSADC
SPI_Reset: U603.3(A) ; port SPI0_Reset
NetC601_1: C601.1 R601.1 U601.16(AIN_0P)
NetC601_2: C601.2 R603.1 U601.17(AIN_0GND)
NetC609_1: C609.1 R604.1 U601.18(AIN_1P)
NetC609_2: C609.2 R611.1 U601.19(AIN_1GND)
NetC612_1: C612.1 R613.1 U601.23(AIN_3P)
NetC612_2: C612.2 R616.1 U601.22(AIN_3GND)
NetC615_1: C615.1 R618.1 U601.21(AIN_2P)
NetC615_2: C615.2 R621.1 U601.20(AIN2_GND)
NetJ1_3: R601.2 R602.1 ; port AN_P0
NetJ1_4: R602.2 R603.2 ; port AN_N0
NetJ1_5: R604.2 R610.1 ; port AN_P1
NetJ1_6: R610.2 R611.2 ; port AN_N1
NetJ1_7: R613.2 R615.1 ; port AN_P2
NetJ1_8: R615.2 R616.2 ; port AN_N2
NetJ1_9: R618.2 R620.1 ; port AN_P3
NetJ1_10: R620.2 R621.2 ; port AN_N3
NetR612_2: R612.2 U602.1(A)
NetR614_2: R614.2 U603.1(A)
NetR617_2: R617.2 U604.1(A)
NetR619_2: R619.2 U605.1(A)
NetR622_1: R622.1 U606.1(A)

Not connected (* = marked no-connect by the designer): U601 3(DAISY)* 12(NC)* 13(NC)* 14(NC)* 15(NC)* 24(NC)* 25(NC)* 26(NC)* 27(NC)* 35(DNC)*

### Notes on the sheet
- ADC Calculation for ADS8684IDBTR
  Vch = (ADC/65535) x (4.096 x 2.5)
  Ich = (ADC/65535) x (4.096 x 2.5) x 1000 / 499 mA
- Title :
- Revision :
- ผู้จัดทำ:
- Size:
- A3
- Time:
- ผู้เขียน:
- บริษัท ยูนิเวอร์แซล ยูทีลิตี้ส์ จำกัด (มหาชน) เลขที่ 1 อาคาร อีสท์วอเตอร์ ชั้น 18 ซอยวิภาวดีรังสิต 5 แขวงจอมพล เขตจตุจักร กรุงเทพฯ 10900
  Tel : +662-272-1688
  Fax :+662-2721690-1
- -
- Sheet:
- of
- ผู้อำนวยการ
- ผู้ตรวจสอบ:
- Number:
- กรรมการผู้จัดการ:
- File:

### Library data of the parts
C601 C602 C609-C616 = C_Capacitor: as C2 on sheet 0_Overview; PackageReference: 0603; PartID: 399-5089-1-ND; Value2: 50V; Value: 0.1uF; Value3: *
C603 C604 = C_Capacitor: CAP CER 10UF 10V X6S 0603; Manufacturer: Murata Electronics; PartNumber: GRT188C81A106ME13D; PackageReference: 0603; PartID: 490-12283-1-ND; Value2: 10V; Value: 10uF; Value3: *
C605 = C_Capacitor: CAP CER 22UF 10V X5R 0603; Manufacturer: Murata Electronics; PartNumber: GRM187R61A226ME15D; PackageReference: 0603; PartID: 490-13243-1-ND; Value2: 10V; Value: 22uF; Value3: *
C606-C608 = C_Capacitor: CAP CER 1UF 50V X5R 0603; Manufacturer: Murata Electronics; PartNumber: GRT188R61H105KE13D; PackageReference: 0603; PartID: 490-12330-1-ND; Value2: 50V; Value: 1uF; Value3: *
R601 R603 R604 R611 R613 R616 R618 R621 = R_Resister: RES SMD 1K OHM 5% 1/10W 0603; Manufacturer: Vishay Dale; PartNumber: CRCW06031K00JNEA; Value2: 0.1W; Value: 1K; PackageReference: 0603; PartID: 541-1.0KGCT-ND; Value3: *
R602 R610 R615 R620 = R_Resister: RES SMD 499 OHM 1% 1/3W 0603; Manufacturer: Vishay Dale; PartNumber: CRCW0603499RFKEAHP; Value2: 0.333W; Value: 499R; PackageReference: 0603; PartID: 541-499SCT-ND; Value3: *
R605-R609 R623 = R_Resister: RES 4.7K OHM 5% 1/10W 0603; Manufacturer: Vishay Dale; PartNumber: CRCW06034K70JNEBC; Value2: 0.1W; Value: 4.7k; PackageReference: 0603; PartID: 541-CRCW06034K70JNEBCCT-ND; Value3: *
R612 R614 R617 R619 R622 = R_Resister: as R1 on sheet 0_Overview; Value: 499R; PackageReference: 0603; PartID: 541-3986-1-ND; Value3: *
U601 = IC_ADC_ADS8684IDBTR: IC ADC 16BIT SAR 38TSSOP; Manufacturer: Texas Instruments; Value3: TIPD166; Value: ADS8684IDBTR; PackageReference: 38-TSSOP; PartID: 296-39875-1-ND; PartNumber: ADS8684IDBTR
U602-U606 = IC_OPTO_TLP109(TPR,E): OPTOISO 5KV PUSH PULL SO6L; Manufacturer: Toshiba Semiconductor and Storage; Value: TLP2362(TPL,E(T; PackageReference: SO-6; PartID: C37658; PartNumber: TLP2362(TPL,E(T; Value2: TLP2362(TPL,E(T; Value3: TLP109(TPR,E)

## Sheet 5_Digitrol.SchDoc
size A3; DocumentNumber: 5; SheetNumber: 5; SheetTotal: 6
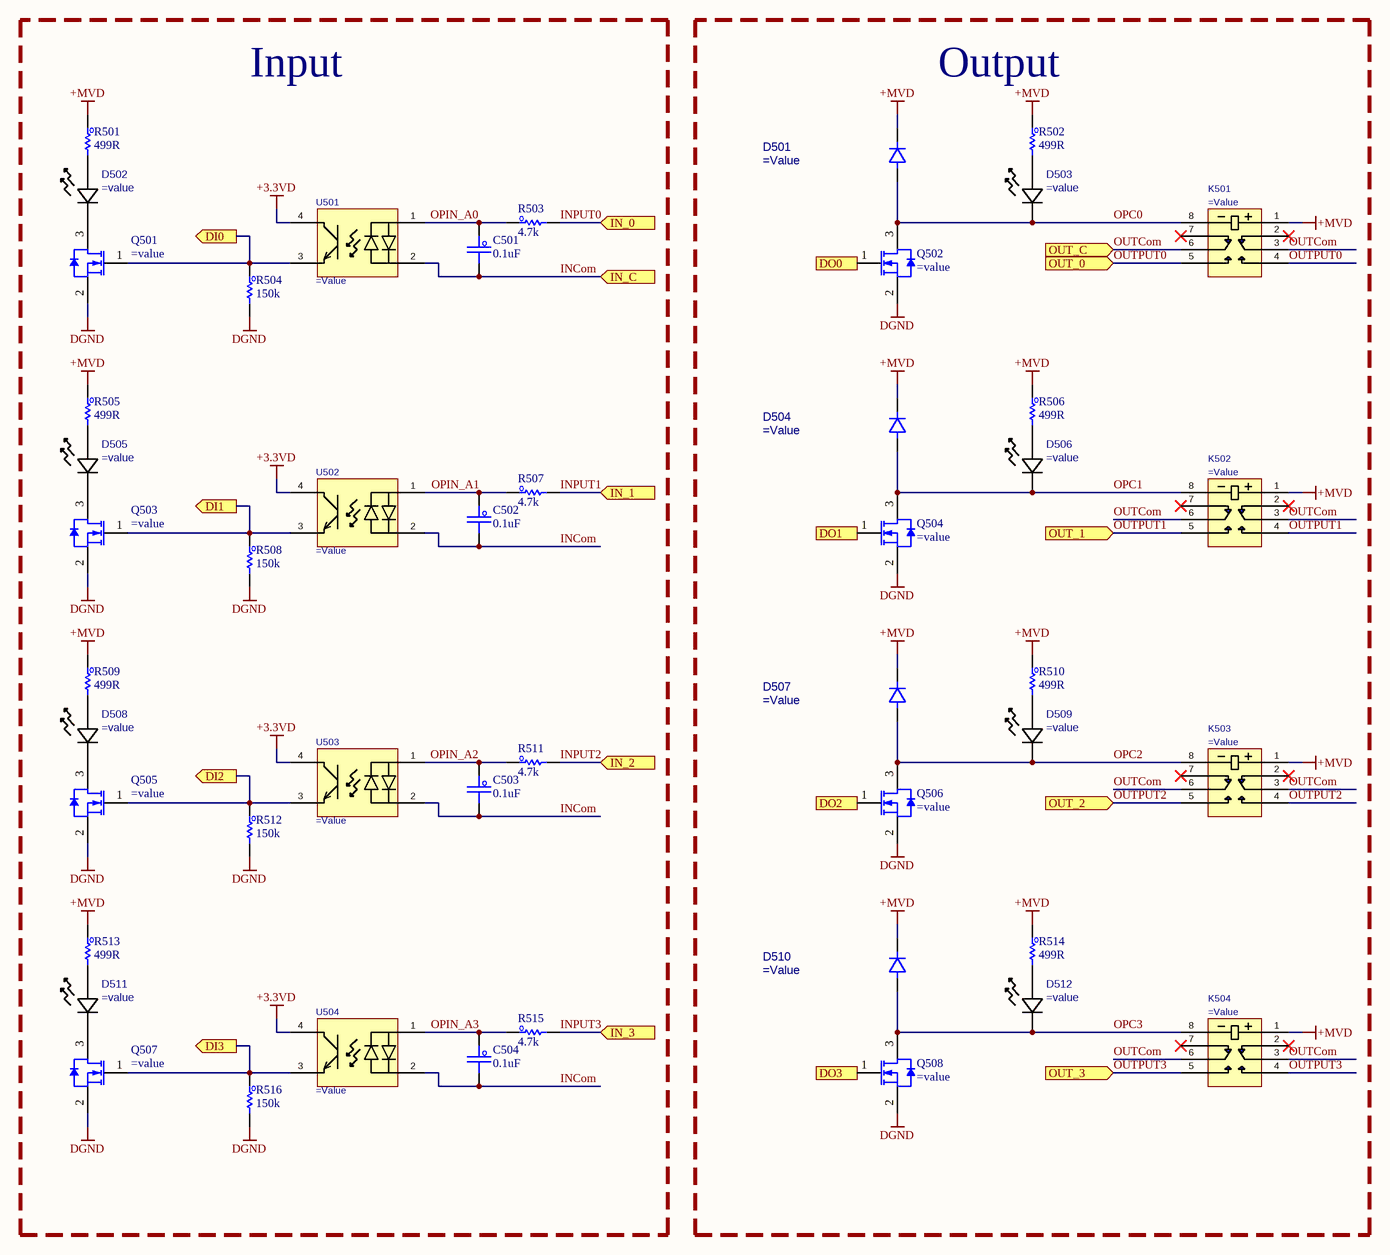
[diagram p3: 5_Digitrol.SchDoc]

### Parts
C501  0.1uF  [C_0603]
C502  0.1uF  [C_0603]
C503  0.1uF  [C_0603]
C504  0.1uF  [C_0603]
D501  (no value)  [DFN119P160X30-2M]
D502  (no value)  [LED_0VS75000_WRE]
D503  (no value)  [LED_0VS75000_WRE]
D504  (no value)  [DFN119P160X30-2M]
D505  (no value)  [LED_0VS75000_WRE]
D506  (no value)  [LED_0VS75000_WRE]
D507  (no value)  [DFN119P160X30-2M]
D508  (no value)  [LED_0VS75000_WRE]
D509  (no value)  [LED_0VS75000_WRE]
D510  (no value)  [DFN119P160X30-2M]
D511  (no value)  [LED_0VS75000_WRE]
D512  (no value)  [LED_0VS75000_WRE]
K501  (no value)  [RELAY_HFD4/12-SR]
K502  (no value)  [RELAY_HFD4/12-SR]
K503  (no value)  [RELAY_HFD4/12-SR]
K504  (no value)  [RELAY_HFD4/12-SR]
Q501  (no value)  [SOT95P245X110-3M]
Q502  (no value)  [SOT95P245X110-3M]
Q503  (no value)  [SOT95P245X110-3M]
Q504  (no value)  [SOT95P245X110-3M]
Q505  (no value)  [SOT95P245X110-3M]
Q506  (no value)  [SOT95P245X110-3M]
Q507  (no value)  [SOT95P245X110-3M]
Q508  (no value)  [SOT95P245X110-3M]
R501  499R  [R_0603]
R502  499R  [R_0603]
R503  4.7k  [R_0603]
R504  150k  [R_0603]
R505  499R  [R_0603]
R506  499R  [R_0603]
R507  4.7k  [R_0603]
R508  150k  [R_0603]
R509  499R  [R_0603]
R510  499R  [R_0603]
R511  4.7k  [R_0603]
R512  150k  [R_0603]
R513  499R  [R_0603]
R514  499R  [R_0603]
R515  4.7k  [R_0603]
R516  150k  [R_0603]
U501  (no value)  [LTV-814S_LTO]
U502  (no value)  [LTV-814S_LTO]
U503  (no value)  [LTV-814S_LTO]
U504  (no value)  [LTV-814S_LTO]

### Blocks framed on the sheet
Input: C501-C504 D502 D505 D508 D511 Q501 Q503 Q505 Q507 R501 R503-R505 R507-R509 R511-R513 R515 R516 U501-U504
Output: D501 D503 D504 D506 D507 D509 D510 D512 K501-K504 Q502 Q504 Q506 Q508 R502 R506 R510 R514

### Ports
DI0 (out), DI1 (out), DI2 (out), DI3 (out), DO0 (in), DO1 (in), DO2 (in), DO3 (in), IN_0 (in), IN_1 (in), IN_2 (in), IN_3 (in), IN_C (in), OUT_0 (in), OUT_1 (in), OUT_2 (in), OUT_3 (in), OUT_C (in)

### Nets
+3.3VD: U501.4(C) U502.4(C) U503.4(C) U504.4(C)
+MVD: D501.1 D504.1 D507.1 D510.1 K501.1 K502.1 K503.1 K504.1 R501.1 R502.1 R505.1 R506.1 R509.1 R510.1 R513.1 R514.1
DGND: Q501.2(S) Q502.2(S) Q503.2(S) Q504.2(S) Q505.2(S) Q506.2(S) Q507.2(S) Q508.2(S) R504.2 R508.2 R512.2 R516.2
DIN0: Q501.1(G) R504.1 U501.3(E) ; port DI0
DIN1: Q503.1(G) R508.1 U502.3(E) ; port DI1
DIN2: Q505.1(G) R512.1 U503.3(E) ; port DI2
DIN3: Q507.1(G) R516.1 U504.3(E) ; port DI3
DOUT0: Q502.1(G) ; port DO0
DOUT1: Q504.1(G) ; port DO1
DOUT2: Q506.1(G) ; port DO2
DOUT3: Q508.1(G) ; port DO3
INCom: C501.2 C502.2 C503.2 C504.2 U501.2(C_2) U502.2(C_2) U503.2(C_2) U504.2(C_2) ; port IN_C
INPUT0: R503.2 ; port IN_0
INPUT1: R507.2 ; port IN_1
INPUT2: R511.2 ; port IN_2
INPUT3: R515.2 ; port IN_3
OPC0: D501.2 D503.1 K501.8 Q502.3(D)
OPC1: D504.2 D506.1 K502.8 Q504.3(D)
OPC2: D507.2 D509.1 K503.8 Q506.3(D)
OPC3: D510.2 D512.1 K504.8 Q508.3(D)
OPIN_A0: C501.1 R503.1 U501.1(A)
OPIN_A1: C502.1 R507.1 U502.1(A)
OPIN_A2: C503.1 R511.1 U503.1(A)
OPIN_A3: C504.1 R515.1 U504.1(A)
OUTCom: K501.3 K501.6 K502.3 K502.6 K503.3 K503.6 K504.3 K504.6 ; port OUT_C
OUTPUT0: K501.4 K501.5 ; port OUT_0
OUTPUT1: K502.4 K502.5 ; port OUT_1
OUTPUT2: K503.4 K503.5 ; port OUT_2
OUTPUT3: K504.4 K504.5 ; port OUT_3
NetD502_1: D502.1 Q501.3(D)
NetD502_2: D502.2 R501.2
NetD503_2: D503.2 R502.2
NetD505_1: D505.1 Q503.3(D)
NetD505_2: D505.2 R505.2
NetD506_2: D506.2 R506.2
NetD508_1: D508.1 Q505.3(D)
NetD508_2: D508.2 R509.2
NetD509_2: D509.2 R510.2
NetD511_1: D511.1 Q507.3(D)
NetD511_2: D511.2 R513.2
NetD512_2: D512.2 R514.2

Not connected (* = marked no-connect by the designer): K501 2* 7*; K502 2* 7*; K503 2* 7*; K504 2* 7*

### Notes on the sheet
- Title :
- Revision :
- ผู้จัดทำ:
- Size:
- A3
- Time:
- ผู้เขียน:
- บริษัท ยูนิเวอร์แซล ยูทีลิตี้ส์ จำกัด (มหาชน) เลขที่ 1 อาคาร อีสท์วอเตอร์ ชั้น 18 ซอยวิภาวดีรังสิต 5 แขวงจอมพล เขตจตุจักร กรุงเทพฯ 10900
  Tel : +662-272-1688
  Fax :+662-2721690-1
- -
- Sheet:
- of
- ผู้อำนวยการ
- ผู้ตรวจสอบ:
- Number:
- กรรมการผู้จัดการ:
- File:

### Library data of the parts
C501-C504 = C_Capacitor: as C2 on sheet 0_Overview; PackageReference: 0603; PartID: 399-5089-1-ND; Value2: 50V; Value: 0.1uF; Value3: *
D501 D504 D507 D510 = D_PW_VSKY20301608: DIODE SCHOTTKY 30V 2A 0603; Manufacturer: Vishay General Semiconductor - Diodes Division; Value: VSKY20301608-G4-08; PackageReference: 0603; PartID: 112-VSKY20301608-G4-08CT-ND; PartNumber: VSKY20301608-G4-08
D502 D503 D505 D506 D508 D509 D511 D512 = D_LED_150060BS75000: as D201 on sheet 2_MCU; PackageReference: 0603; PartID: 732-4980-1-ND; PartNumber: 150060VS75000
K501-K504 = SW_RELAY_HFD4/12-SR: Telecom Non Latching 12VDC DPDT SMD Relays RoHS; Manufacturer: Xiamen Hongfa Electroacoustic; Value: HFD4/5-SR; PackageReference: *; PartID: C64399; PartNumber: HFD4/5-SR
Q501-Q508 = Q_NMOS_2N7002H: as Q201 on sheet 2_MCU; PackageReference: SOT23; PartID: 2N7002H6327XTSA2CT-ND; PartNumber: 2N7002H6327XTSA2; Value3: *
R501 R502 R505 R506 R509 R510 R513 R514 = R_Resister: as R1 on sheet 0_Overview; Value: 499R; PackageReference: 0603; PartID: 541-3986-1-ND; Value3: *
R503 R507 R511 R515 = R_Resister: as R605 on sheet 6_Analog; Value: 4.7k; PackageReference: 0603; PartID: 541-CRCW06034K70JNEBCCT-ND; Value3: *
R504 R508 R512 R516 = R_Resister: as R206 on sheet 2_MCU; Value: 150k; PackageReference: 0603; PartID: 541-4034-1-ND; Value3: *
U501-U504 = IC_OPTO_LTV-814S-TA1: OPTOISOLATR 5KV TRANSISTOR 4-SMD; Manufacturer: Lite-On Inc.; Value: LTV-814S-TA1; PackageReference: 4-SOP; PartID: 160-1891-1-ND; PartNumber: LTV-814S-TA1

## Sheet 1_Power.SchDoc
size A3; DocumentNumber: 2; SheetNumber: 2; SheetTotal: 6
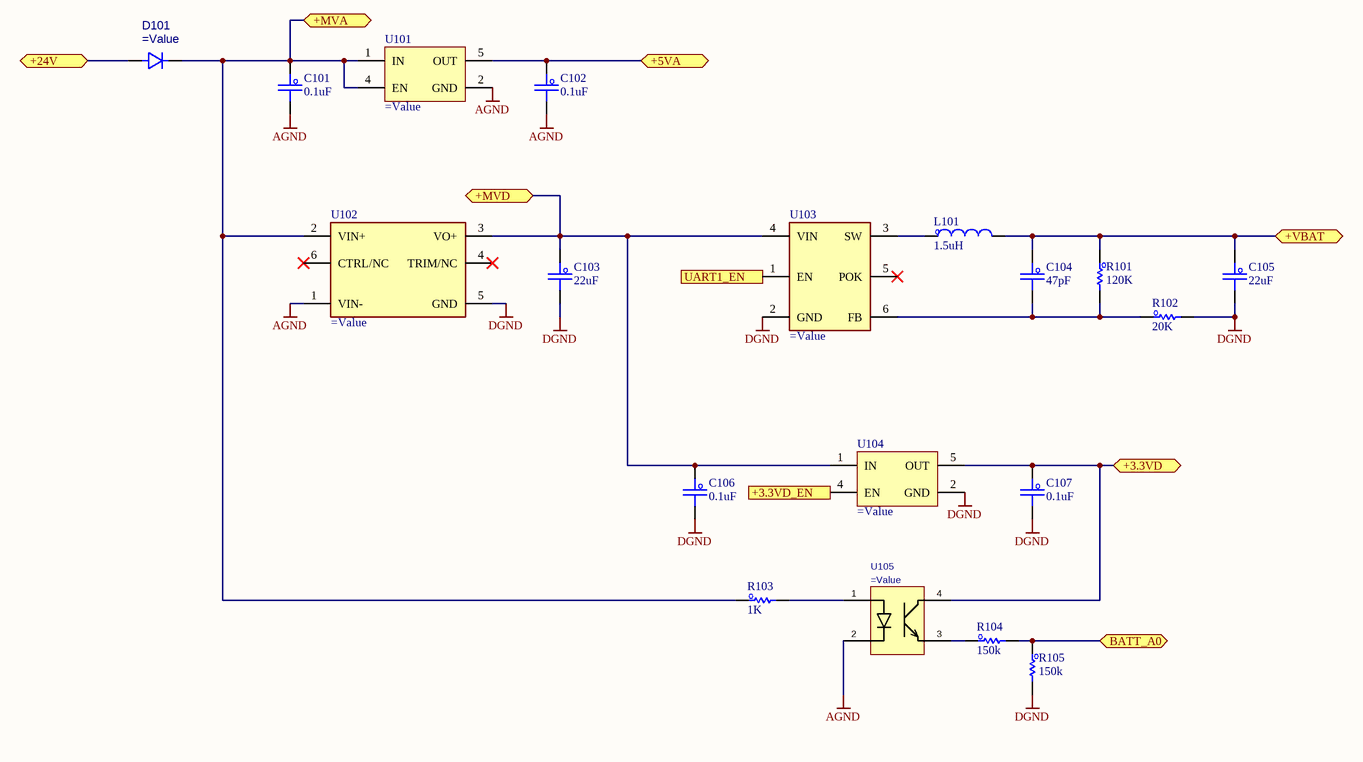
[diagram p4: 1_Power.SchDoc]

### Parts
C101  0.1uF  [C_0603]
C102  0.1uF  [C_0603]
C103  22uF  [C_0603]
C104  47pF  [C_0603]
C105  22uF  [C_0603]
C106  0.1uF  [C_0603]
C107  0.1uF  [C_0603]
D101  (no value)  [DFN119P160X30-2M]
L101  1.5uH  [L_0603]
R101  120K  [R_0603]
R102  20K  [R_0603]
R103  1K  [R_0603]
R104  150k  [R_0603]
R105  150k  [R_0603]
U101  (no value)  [SOT95P280X145-5N]
U102  (no value)  [CONV_HLK-20D2405]
U103  (no value)  [SOT95P270X115-6M]
U104  (no value)  [SOT95P280X145-5N]
U105  (no value)  [SOIC_M618A-3T_VI]

### Ports
+3.3VD (bidir), +3.3VD_EN (in), +5VA (bidir), +24V (bidir), +MVA (bidir), +MVD (bidir), +VBAT (bidir), BATT_A0 (bidir), UART1_EN (in)

### Nets
+3.3VD: C107.1 U104.5(OUT) U105.4(C) ; port +3.3VD
+5VA: C102.1 U101.5(OUT) ; port +5VA
+24V: D101.2 ; port +24V
+MVA: C101.1 D101.1 R103.1 U101.1(IN) U101.4(EN) U102.2(VIN+) ; port +MVA
+MVD: C103.1 C106.1 U102.3(VO+) U103.4(VIN) U104.1(IN) ; port +MVD
+VBAT: C104.1 C105.1 L101.2 R101.1 ; port +VBAT
AGND: C101.2 C102.2 U101.2(GND) U102.1(VIN-) U105.2(C_2)
DGND: C103.2 C105.2 C106.2 C107.2 R102.2 R105.2 U102.5(GND) U103.2(GND) U104.2(GND)
Fuelgauge: R104.2 R105.1 ; port BATT_A0
UART1_LTE_EN: U103.1(EN) ; port UART1_EN
NetC104_2: C104.2 R101.2 R102.1 U103.6(FB)
NetJ201_12: U104.4(EN) ; port +3.3VD_EN
NetL101_1: L101.1 U103.3(SW)
NetR103_2: R103.2 U105.1(A)
NetR104_1: R104.1 U105.3(E)

Not connected (* = marked no-connect by the designer): U102 4(TRIM/NC)* 6(CTRL/NC)*; U103 5(POK)*

### Notes on the sheet
- Title :
- Revision :
- ผู้จัดทำ:
- Size:
- A3
- Time:
- ผู้เขียน:
- บริษัท ยูนิเวอร์แซล ยูทีลิตี้ส์ จำกัด (มหาชน) เลขที่ 1 อาคาร อีสท์วอเตอร์ ชั้น 18 ซอยวิภาวดีรังสิต 5 แขวงจอมพล เขตจตุจักร กรุงเทพฯ 10900
  Tel : +662-272-1688
  Fax :+662-2721690-1
- -
- Sheet:
- of
- ผู้อำนวยการ
- ผู้ตรวจสอบ:
- Number:
- กรรมการผู้จัดการ:
- File:

### Library data of the parts
C101 C102 C106 C107 = C_Capacitor: as C2 on sheet 0_Overview; PackageReference: 0603; PartID: 399-5089-1-ND; Value2: 50V; Value: 0.1uF; Value3: *
C103 C105 = C_Capacitor: CAP CER 22UF 10V X5R 0603; Manufacturer: TDK Corporation; PartNumber: C1608X5R1A226M080AC; PackageReference: 0603; PartID: 445-9077-1-ND; Value2: 10V; Value: 22uF; Value3: *
C104 = C_Capacitor: CAP CER 47PF 50V X7R 0603; Manufacturer: KEMET; PartNumber: C0603C470J5RAC7867; PackageReference: 0603; PartID: 399-C0603C470J5RAC7867CT-ND; Value2: 50V; Value: 47pF; Value3: *
D101 = D_PW_VSKY20301608: as D501 on sheet 5_Digitrol; PackageReference: 0603; PartID: 112-VSKY20301608-G4-08CT-ND; PartNumber: VSKY20301608-G4-08
L101 = L_Inductor: 1.5 µH Shielded Wirewound Inductor 1 A 200mOhm Max 0603 (1608 Metric); Manufacturer: Taiyo Yuden; PartNumber: MBKK1608T1R5M; Value2: 1Mhz; Value: 1.5uH; PackageReference: 0603; PartID: 587-4149-1-ND; Value3: *
R101 = R_Resister: RES 120K OHM 5% 1/10W 0603; Manufacturer: YAGEO; PartNumber: RC0603JR-07120KL; Value2: 0.1W; Value: 120K; PackageReference: 0603; PartID: 311-120KGRCT-ND; Value3: *
R102 = R_Resister: RES 20K OHM 1% 1/10W 0603; Manufacturer: YAGEO; PartNumber: RC0603FR-0720KL; Value2: 0.1W; Value: 20K; PackageReference: 0603; PartID: 311-20.0KHRCT-ND; Value3: *
R103 = R_Resister: as R601 on sheet 6_Analog; Value: 1K; PackageReference: 0603; PartID: 541-1.0KGCT-ND; Value3: *
R104 R105 = R_Resister: as R206 on sheet 2_MCU; Value: 150k; PackageReference: 0603; PartID: 541-4034-1-ND; Value3: *
U101 = IC_LDO_RT9069-33GB: IC REG LINEAR 5V 200MA SOT23-5; PartNumber: RT9069-50GB; Manufacturer: Richtek Tech; Value: RT9069-50GB; PartID: 1028-1505-1-ND; PackageReference: SOT-23-5; Value2: *; Value3: *
U102 = IC_PMS_HLK-X0D2405: 20W DC/DC IN 9-36V OUT 5V; Manufacturer: HI-LINK; Value: HLK-10D2405; PackageReference: *; PartID: C2761163; PartNumber: HLK-10D2405
U103 = IC_PMS_JW5222: DC DC CONVERTER 5V 5W; PartNumber: JW5222; Manufacturer: JoulWatt Tech; Value: JW5222; PartID: C371424; PackageReference: SOT-23-5; Value2: *; Value3: *
U104 = IC_LDO_RT9069-33GB: 200mA 360mV@(10mA) Fixed 3.3V~3.3V Positive 1 36V SOT-23-5 Linear Voltage Regulators (LDO) ROHS; Manufacturer: Richtek Tech; PartNumber: RT9069-33GB; PartID: C147969; PackageReference: SOT-23-5; Value: RT9069-33GB; Value2: *; Value3: *
U105 = IC_OPTO_VOM618A-3T: OPTOISOLATOR 3.75KV TRANS 4-SOP; Manufacturer: Vishay; Value: VOM618A-3T; PackageReference: 4-SOP; PartID: VOM618A-3CT-ND; PartNumber: VOM618A-3T

## Sheet 3_BackBone.SchDoc
size A3; DocumentNumber: 4; SheetNumber: 4; SheetTotal: 6
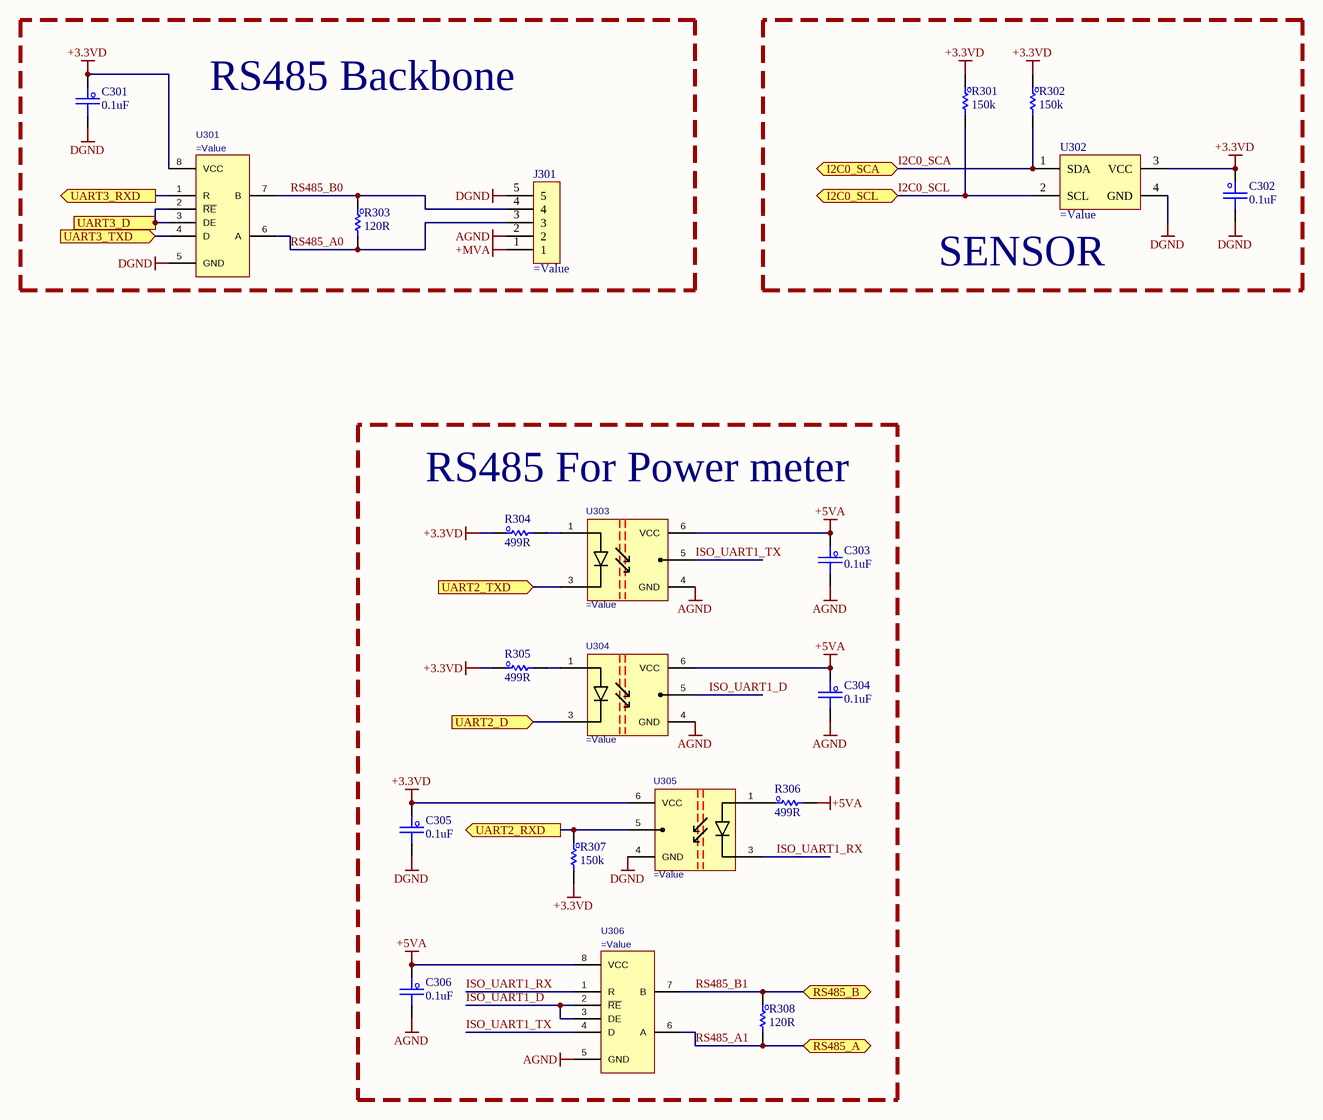
[diagram p5: 3_BackBone.SchDoc]

### Parts
C301  0.1uF  [C_0603]  (no BOM)
C302  0.1uF  [C_0603]
C303  0.1uF  [C_0603]
C304  0.1uF  [C_0603]
C305  0.1uF  [C_0603]
C306  0.1uF  [C_0603]
J301  (no value)  [CON_9155005541006]  (no BOM)
R301  150k  [R_0603]
R302  150k  [R_0603]
R303  120R  [R_0603]  (no BOM)
R304  499R  [R_0603]
R305  499R  [R_0603]
R306  499R  [R_0603]
R307  150k  [R_0603]
R308  120R  [R_0603]
U301  (no value)  [D0008A_L]  (no BOM)
U302  (no value)  [XDCR_SHT40-AD1B-R2]
U303  (no value)  [5PIN SO6_TOS]
U304  (no value)  [5PIN SO6_TOS]
U305  (no value)  [5PIN SO6_TOS]
U306  (no value)  [D0008A_L]

### Blocks framed on the sheet
RS485 Backbone: C301 J301 R303 U301
SENSOR: C302 R301 R302 U302
RS485 For Power meter: C303-C306 R304-R308 U303-U306

### Ports
I2C0_SCA (bidir), I2C0_SCL (bidir), RS485_A (bidir), RS485_B (bidir), UART2_D (in), UART2_RXD (out), UART2_TXD (in), UART3_D (in), UART3_RXD (out), UART3_TXD (in)

### Nets
+3.3VD: C301.1 C302.1 C305.1 R301.1 R302.1 R304.1 R305.1 R307.2 U301.8(VCC) U302.3(VCC) U305.6(VCC)
+5VA: C303.1 C304.1 C306.1 R306.2 U303.6(VCC) U304.6(VCC) U306.8(VCC)
+MVA: J301.1
AGND: C303.2 C304.2 C306.2 J301.2 U303.4(GND) U304.4(GND) U306.5(GND)
DGND: C301.2 C302.2 C305.2 J301.5 U301.5(GND) U302.4(GND) U305.4(GND)
BackBone_D: U301.2(~{RE}) U301.3(DE) ; port UART3_D
BackBone_RX: U301.1(R) ; port UART3_RXD
BackBone_TX: U301.4(D) ; port UART3_TXD
I2C0_SCA: R302.2 U302.1(SDA) ; port I2C0_SCA
I2C0_SCL: R301.2 U302.2(SCL) ; port I2C0_SCL
ISO_UART1_D: U304.5(O1) U306.2(~{RE}) U306.3(DE)
ISO_UART1_RX: U305.3(A) U306.1(R)
ISO_UART1_TX: U303.5(O1) U306.4(D)
RS485_A0: J301.3 R303.2 U301.6(A)
RS485_A1: R308.2 U306.6(A) ; port RS485_A  [project net RS485_A]
RS485_B0: J301.4 R303.1 U301.7(B)
RS485_B1: R308.1 U306.7(B) ; port RS485_B  [project net RS485_B]
RS485_D: U304.3(A) ; port UART2_D
RS485_RX: R307.1 U305.5(O1) ; port UART2_RXD
RS485_TX: U303.3(A) ; port UART2_TXD
NetR304_2: R304.2 U303.1(A)
NetR305_2: R305.2 U304.1(A)
NetR306_1: R306.1 U305.1(A)

### Notes on the sheet
- Title :
- Revision :
- ผู้จัดทำ:
- Size:
- A3
- Time:
- ผู้เขียน:
- บริษัท ยูนิเวอร์แซล ยูทีลิตี้ส์ จำกัด (มหาชน) เลขที่ 1 อาคาร อีสท์วอเตอร์ ชั้น 18 ซอยวิภาวดีรังสิต 5 แขวงจอมพล เขตจตุจักร กรุงเทพฯ 10900
  Tel : +662-272-1688
  Fax :+662-2721690-1
- -
- Sheet:
- of
- ผู้อำนวยการ
- ผู้ตรวจสอบ:
- Number:
- กรรมการผู้จัดการ:
- File:

### Library data of the parts
C301-C306 = C_Capacitor: as C2 on sheet 0_Overview; PackageReference: 0603; PartID: 399-5089-1-ND; Value2: 50V; Value: 0.1uF; Value3: *
J301 = CON_5P_9155005541006: CONN SPRING BATTERY 5POS R/A SMD; PartNumber: 009155005541006; Manufacturer: AVX; Value: 009155005541006; PartID: 478-5453-1-ND; PackageReference: *; Value2: *; Value3: *
R301 R302 R307 = R_Resister: as R206 on sheet 2_MCU; Value: 150k; PackageReference: 0603; PartID: 541-4034-1-ND; Value3: *
R303 R308 = R_Resister: RES SMD 120 OHM 1% 1/3W 0603; Manufacturer: Vishay Dale; PartNumber: CRCW0603120RFKEAHP; Value2: 0.333W; Value: 120R; PackageReference: 0603; PartID: 541-120SCT-ND; Value3: *
R304-R306 = R_Resister: as R1 on sheet 0_Overview; Value: 499R; PackageReference: 0603; PartID: 541-3986-1-ND; Value3: *
U301 = IC_TRAN_THVD1505DR: IC TRANSCEIVER HALF 1/1 8SOIC; Manufacturer: Texas Instruments; PartNumber: SN65HVD11DR; Value: SN65HVD11DR; Value3: SN65HVD1780QDRQ1; PackageReference: 8SOIC; PartID: 0086-0766-1; Value2: SN65HVD11DR
U302 = IC_SEN_SHT40-AD1B-R3: SENSOR HUMIDITY 100 RH SMD; Manufacturer: Sensirion AG; PartNumber: SHT40-AD1B-R3; PartID: 1649-SHT40-AD1B-R3CT-ND; PackageReference: QFN-4; Value: SHT40-AD1B-R3; Value2: *; Value3: *
U303-U305 = IC_OPTO_TLP109(TPR,E): as U602 on sheet 6_Analog; PackageReference: SO-6; PartID: C37658; PartNumber: TLP2362(TPL,E(T; Value2: TLP2362(TPL,E(T; Value3: TLP109(TPR,E)
U306 = IC_TRAN_THVD1505DR: IC TRANSCEIVER HALF 1/1 8SOIC; Manufacturer: Texas Instruments; PartNumber: SN75176BDR; Value: SN75176BDR; Value3: SN65HVD1780QDRQ1; PackageReference: 8SOIC; PartID: 0086-0274-6

## Sheet 4_PCConnection.SchDoc
size A3; DocumentNumber: 4; SheetNumber: 4; SheetTotal: 6
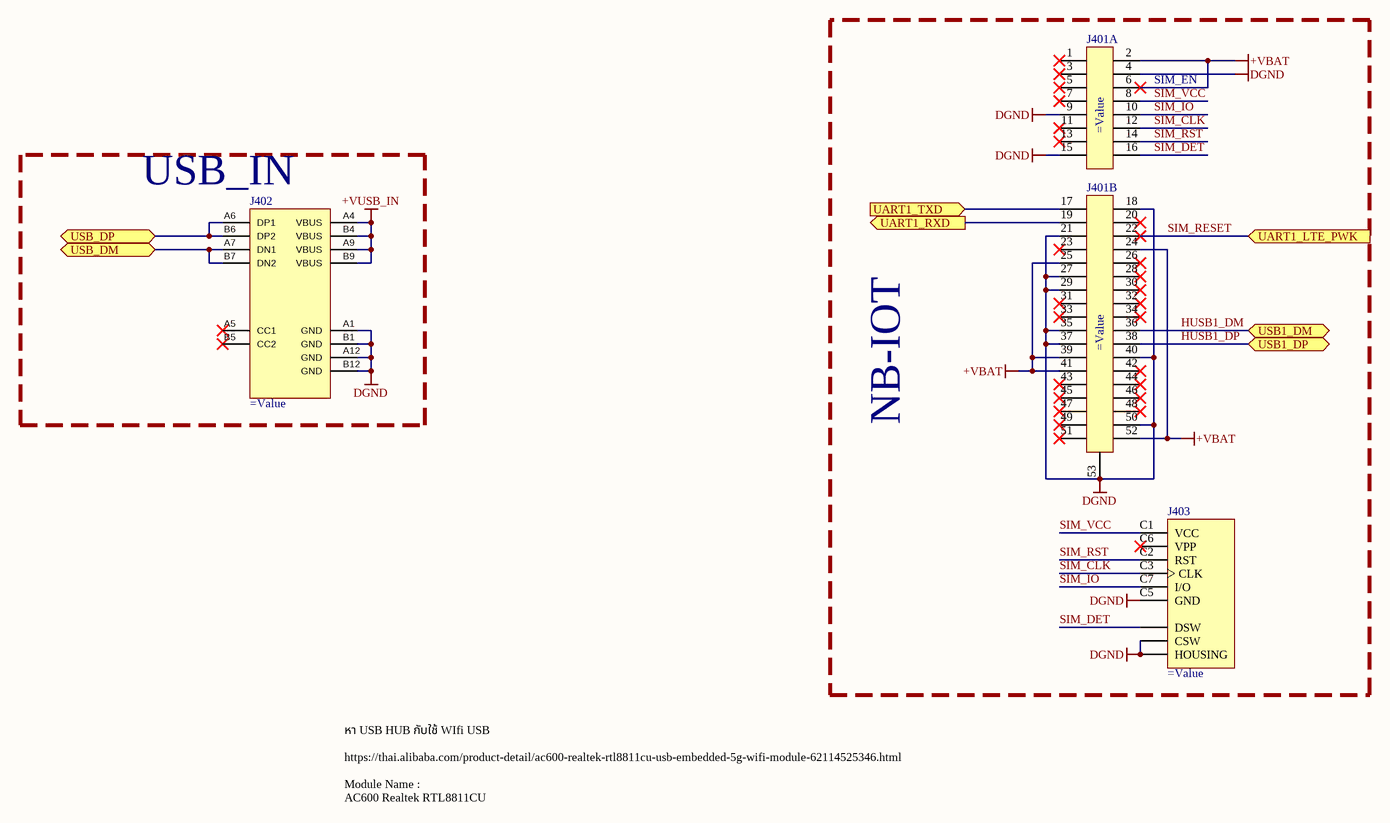
[diagram p6: 4_PCConnection.SchDoc]

### Parts
J401  (no value)  [TE_2041119-1]  (parts A,B of 2)
J402  (no value)  [216989-0001_MOL_2169890001]
J403  (no value)  [JAE_SF72S006VBDR2500]

### Blocks framed on the sheet
NB-IOT: J401 J403
USB_IN: J402

### Ports
UART1_LTE_PWK (in), UART1_RXD (out), UART1_TXD (in), USB1_DM (bidir), USB1_DP (bidir), USB_DM (bidir), USB_DP (bidir)

### Nets
+VBAT: J401.2 J401.6 J401.24 J401.25 J401.39 J401.41 J401.52
+VUSB_IN: J402.A4(VBUS) J402.A9(VBUS) J402.B4(VBUS) J402.B9(VBUS)
DGND: J401.4 J401.9 J401.15 J401.18 J401.21 J401.27 J401.29 J401.35 J401.37 J401.40 J401.50 J401.53 J402.A1(GND) J402.A12(GND) J402.B1(GND) J402.B12(GND) J403.C5(GND) J403.CSW J403.SH(HOUSING)
HUSB1_DM: J401.36 ; port USB1_DM
HUSB1_DP: J401.38 ; port USB1_DP
SIM_CLK: J401.12 J403.C3(CLK)
SIM_DET: J401.16 J403.DSW
SIM_IO: J401.10 J403.C7(I/O)
SIM_RESET: J401.22 ; port UART1_LTE_PWK
SIM_RST: J401.14 J403.C2(RST)
SIM_VCC: J401.8 J403.C1(VCC)
UART1_LTE_RX: J401.19 ; port UART1_RXD
UART1_LTE_TX: J401.17 ; port UART1_TXD
USB_DM: J402.A6(DP1) J402.B6(DP2) ; port USB_DP
USB_DP: J402.A7(DN1) J402.B7(DN2) ; port USB_DM

Not connected (* = marked no-connect by the designer): J401 1* 3* 5* 7* 11* 13* 20* 23* 26* 28* 30* 31* 32* 33* 34* 42* 43* 44* 45* 46* 47* 48* 49* 51*; J402 A5(CC1)* B5(CC2)*; J403 C6(VPP)*

### Notes on the sheet
- (near J401) SIM_EN
- หา USB HUB กับใช้ WIfi USB
  https://thai.alibaba.com/product-detail/ac600-realtek-rtl8811cu-usb-embedded-5g-wifi-module-62114525346.html
  Module Name :
  AC600 Realtek RTL8811CU
- Title :
- Revision :
- ผู้จัดทำ:
- Size:
- A3
- Time:
- ผู้เขียน:
- บริษัท ยูนิเวอร์แซล ยูทีลิตี้ส์ จำกัด (มหาชน) เลขที่ 1 อาคาร อีสท์วอเตอร์ ชั้น 18 ซอยวิภาวดีรังสิต 5 แขวงจอมพล เขตจตุจักร กรุงเทพฯ 10900
  Tel : +662-272-1688
  Fax :+662-2721690-1
- -
- Sheet:
- of
- ผู้อำนวยการ
- ผู้ตรวจสอบ:
- Number:
- กรรมการผู้จัดการ:
- File:

### Library data of the parts
J401 = CON_PCI-E-52P: CONN PCI EXP MINI FEMALE 52POS; PartNumber: 2041119-1; Manufacturer: TE Connectivity AMP Connectors; Value: 2041119-1; PartID: A108265CT-ND; PackageReference: *; Value2: *; Value3: *
J402 = CON_USBC_RIGHTANG: CONN RCPT USB2.0 TYPE C 24POS RA; PartNumber: 2169890001; Manufacturer: Molex; Value: 2169890001; Value2: KUSBX-SL-CS1N14-B; PartID: 900-2169890001CT-ND; PackageReference: *; Value3: *
J403 = CON_SIM_NanoSP: NANO SIM CARD CONNECTOR; PartNumber: SF72S006VBDR2500; Manufacturer: JAE Electronics; Value: SF72S006VBDR2500; PartID: 670-2967-1-ND; PackageReference: *; Value2: *; Value3: *

## Nets that join several sheets
+3.3VD: 0_Overview (R2.1), 2_MCU (9 pins), 6_Analog (7 pins), 5_Digitrol (U501.4 U502.4 U503.4 U504.4), 1_Power (C107.1 U104.5 U105.4), 3_BackBone (11 pins)
+5VA: 6_Analog (21 pins), 1_Power (C102.1 U101.5), 3_BackBone (7 pins)
+24V: 0_Overview (J2.1), 1_Power (D101.2)
+MVA: 0_Overview (J1.1), 1_Power (6 pins), 3_BackBone (J301.1)
+MVD: 2_MCU (J201.1 J201.2 J201.3 J201.4), 5_Digitrol (16 pins), 1_Power (5 pins)
+VBAT: 1_Power (C104.1 C105.1 L101.2 R101.1), 4_PCConnection (7 pins)
+VUSB_IN: 2_MCU (J201.86), 4_PCConnection (J402.A4 J402.A9 J402.B4 J402.B9)
AGND: 0_Overview (C1.1 J1.2 J2.2), 6_Analog (23 pins), 1_Power (5 pins), 3_BackBone (7 pins)
DGND: 0_Overview (5 pins), 2_MCU (11 pins), 6_Analog (C616.2 U606.4), 5_Digitrol (12 pins), 1_Power (9 pins), 3_BackBone (7 pins), 4_PCConnection (19 pins)
BackBone_D: 2_MCU (J201.132 TP224.1), 3_BackBone (U301.2 U301.3)
BackBone_RX: 2_MCU (J201.126 TP220.1), 3_BackBone (U301.1)
BackBone_TX: 2_MCU (J201.124 TP218.1), 3_BackBone (U301.4)
DIN0: 2_MCU (J201.66 TP202.1), 5_Digitrol (Q501.1 R504.1 U501.3)
DIN1: 2_MCU (J201.68 TP204.1), 5_Digitrol (Q503.1 R508.1 U502.3)
DIN2: 2_MCU (J201.65 TP201.1), 5_Digitrol (Q505.1 R512.1 U503.3)
DIN3: 2_MCU (J201.67 TP203.1), 5_Digitrol (Q507.1 R516.1 U504.3)
DOUT0: 2_MCU (J201.69 TP205.1), 5_Digitrol (Q502.1)
DOUT1: 2_MCU (J201.73 TP206.1), 5_Digitrol (Q504.1)
DOUT2: 2_MCU (J201.75 TP207.1), 5_Digitrol (Q506.1)
DOUT3: 2_MCU (J201.77 TP208.1), 5_Digitrol (Q508.1)
Fuelgauge: 2_MCU (J201.165 TP236.1), 1_Power (R104.2 R105.1)
HUSB1_DM: 2_MCU (J201.83 TP209.1), 4_PCConnection (J401.36)
HUSB1_DP: 2_MCU (J201.85 TP210.1), 4_PCConnection (J401.38)
I2C0_SCA: 2_MCU (J201.137 TP226.1), 3_BackBone (R302.2 U302.1)
I2C0_SCL: 2_MCU (J201.135 TP225.1), 3_BackBone (R301.2 U302.2)
INCom: 0_Overview (J3.1), 5_Digitrol (8 pins)
INPUT0: 0_Overview (J3.2), 5_Digitrol (R503.2)
INPUT1: 0_Overview (J3.3), 5_Digitrol (R507.2)
INPUT2: 0_Overview (J3.4), 5_Digitrol (R511.2)
INPUT3: 0_Overview (J3.5), 5_Digitrol (R515.2)
LED_1000n/100n_R: 0_Overview (R1.1), 2_MCU (Q202.3 Q203.3)
LED_ACT: 0_Overview (J4.14), 2_MCU (J201.197 TP244.1)
NetJ1_3: 0_Overview (J1.3), 6_Analog (R601.2 R602.1)
NetJ1_4: 0_Overview (J1.4), 6_Analog (R602.2 R603.2)
NetJ1_5: 0_Overview (J1.5), 6_Analog (R604.2 R610.1)
NetJ1_6: 0_Overview (J1.6), 6_Analog (R610.2 R611.2)
NetJ1_7: 0_Overview (J1.7), 6_Analog (R613.2 R615.1)
NetJ1_8: 0_Overview (J1.8), 6_Analog (R615.2 R616.2)
NetJ1_9: 0_Overview (J1.9), 6_Analog (R618.2 R620.1)
NetJ1_10: 0_Overview (J1.10), 6_Analog (R620.2 R621.2)
NetJ201_12: 2_MCU (J201.12), 1_Power (U104.4)
OUTCom: 0_Overview (J3.6), 5_Digitrol (8 pins)
OUTPUT0: 0_Overview (J3.7), 5_Digitrol (K501.4 K501.5)
OUTPUT1: 0_Overview (J3.8), 5_Digitrol (K502.4 K502.5)
OUTPUT2: 0_Overview (J3.9), 5_Digitrol (K503.4 K503.5)
OUTPUT3: 0_Overview (J3.10), 5_Digitrol (K504.4 K504.5)
RGMII1_TRN0: 0_Overview (J4.2), 2_MCU (J201.179)
RGMII1_TRN1: 0_Overview (J4.4), 2_MCU (J201.183)
RGMII1_TRN2: 0_Overview (J4.6), 2_MCU (J201.189)
RGMII1_TRN3: 0_Overview (J4.9), 2_MCU (J201.193)
RGMII1_TRP0: 0_Overview (J4.3), 2_MCU (J201.177)
RGMII1_TRP1: 0_Overview (J4.7), 2_MCU (J201.181)
RGMII1_TRP2: 0_Overview (J4.5), 2_MCU (J201.187)
RGMII1_TRP3: 0_Overview (J4.8), 2_MCU (J201.191)
RS485_A: 0_Overview (J2.3), 3_BackBone (R308.2 U306.6)
RS485_B: 0_Overview (J2.4), 3_BackBone (R308.1 U306.7)
RS485_D: 2_MCU (J201.130 TP222.1), 3_BackBone (U304.3)
RS485_RX: 2_MCU (J201.125 TP219.1), 3_BackBone (R307.1 U305.5)
RS485_TX: 2_MCU (J201.123 TP217.1), 3_BackBone (U303.3)
SIM_RESET: 2_MCU (Q201.3), 4_PCConnection (J401.22)
SPI0_MISO: 2_MCU (J201.142 TP230.1), 6_Analog (R623.2 U606.5)
SPI0_MOSI: 2_MCU (J201.141 TP229.1), 6_Analog (U602.3)
SPI0_SCK: 2_MCU (J201.140 TP228.1), 6_Analog (U604.3)
SPI_CSADC: 2_MCU (J201.139 TP227.1), 6_Analog (U605.3)
SPI_Reset: 2_MCU (J201.148 TP231.1), 6_Analog (U603.3)
UART1_LTE_EN: 2_MCU (J201.114 TP211.1), 1_Power (U103.1)
UART1_LTE_RX: 2_MCU (J201.120 TP216.1), 4_PCConnection (J401.19)
UART1_LTE_TX: 2_MCU (J201.118 TP214.1), 4_PCConnection (J401.17)
USB_DM: 2_MCU (J201.91), 4_PCConnection (J402.A6 J402.B6)
USB_DP: 2_MCU (J201.89), 4_PCConnection (J402.A7 J402.B7)